# EAGLE design DBG-001 (EAGLE 9.6.0)

## Sheet 1 of 3
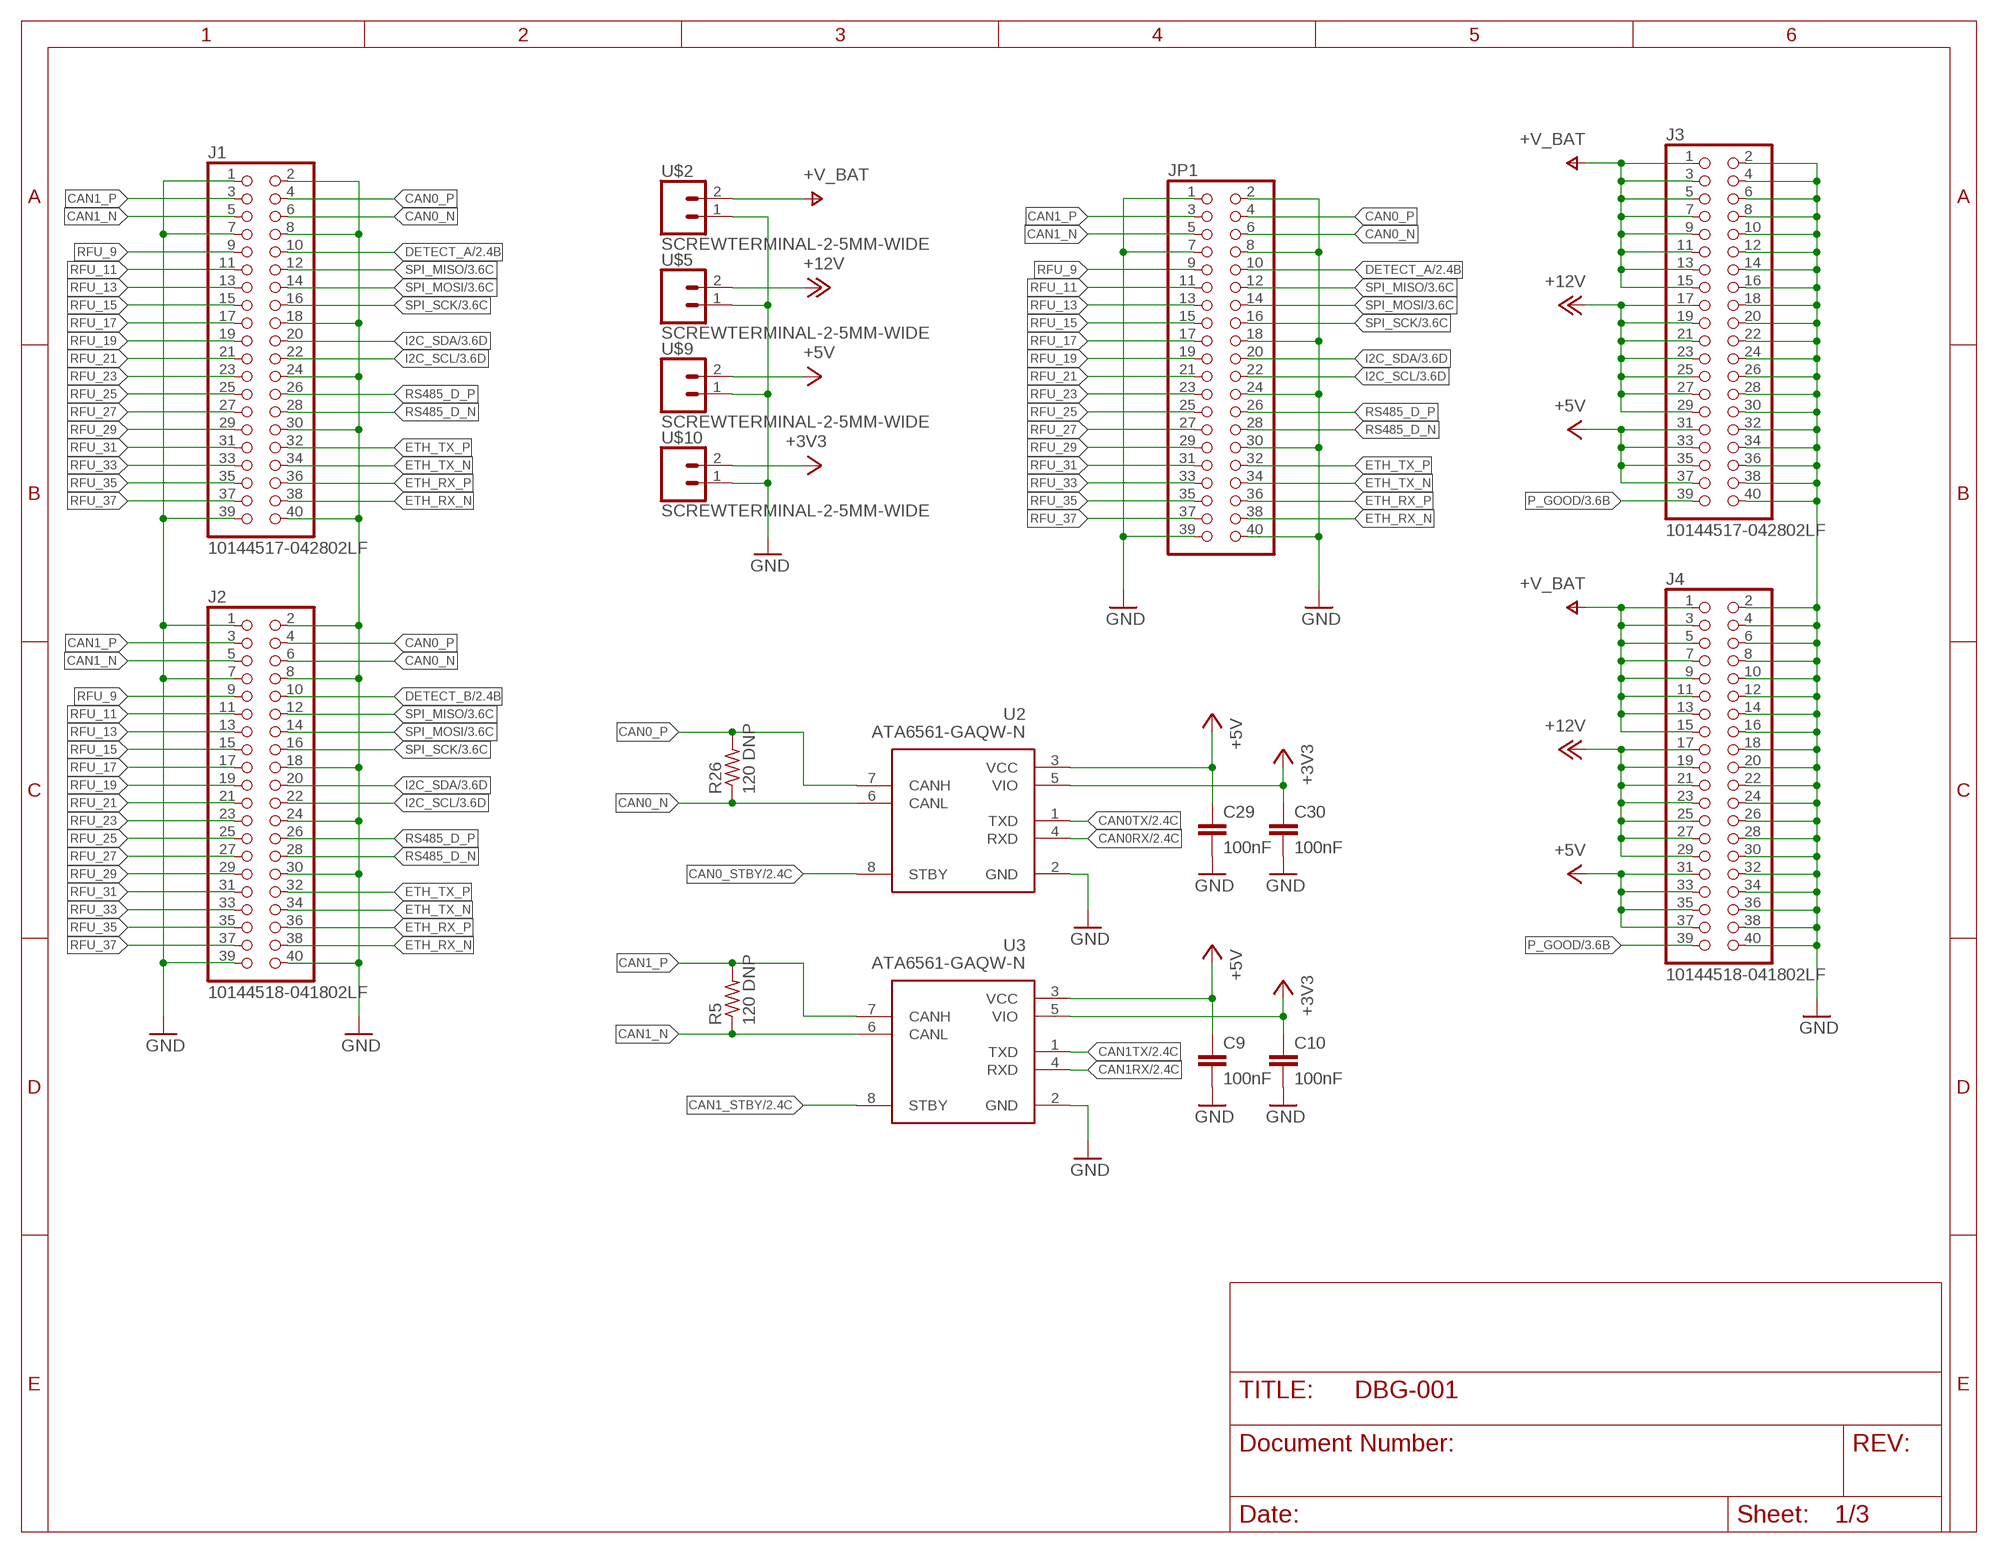
[diagram p0: schematic, sheet 1]

### Parts
C9  100nF  C-EUC0402  [C0402]
C10  100nF  C-EUC0402  [C0402]
C29  100nF  C-EUC0402  [C0402]
C30  100nF  C-EUC0402  [C0402]
J1  10144517-042802LF  [10144517-042802LF]
J2  10144518-041802LF  [10144518-041802LF]
J3  10144517-042802LF  [10144517-042802LF]
J4  10144518-041802LF  [10144518-041802LF]
JP1  PINHD-2X20  [2X20]
R5  120 DNP  R-US_R0402  [R0402]
R26  120 DNP  R-US_R0402  [R0402]
U2  ATA6561-GAQW-N  [SOIC127P600X175-8N]
U3  ATA6561-GAQW-N  [SOIC127P600X175-8N]
U$2  SCREWTERMINAL-2-5MM-WIDE  [SCREWTERMINAL-5MM-2-WIDE]
U$5  SCREWTERMINAL-2-5MM-WIDE  [SCREWTERMINAL-5MM-2-WIDE]
U$9  SCREWTERMINAL-2-5MM-WIDE  [SCREWTERMINAL-5MM-2-WIDE]
U$10  SCREWTERMINAL-2-5MM-WIDE  [SCREWTERMINAL-5MM-2-WIDE]

### Nets
+3V3: C10.1 C30.1 U2.5(VIO) U3.5(VIO) U$10.2 ; also sheet 2,3
+5V: C9.1 C29.1 J3.31 J3.33 J3.35 J3.37 J4.31 J4.33 J4.35 J4.37 U2.3(VCC) U3.3(VCC) U$9.2 ; also sheet 2
+12V: J3.17 J3.19 J3.21 J3.23 J3.25 J3.27 J3.29 J4.17 J4.19 J4.21 J4.23 J4.25 J4.27 J4.29 U$5.2
+V_BAT: J3.1 J3.3 J3.5 J3.7 J3.9 J3.11 J3.13 J3.15 J4.1 J4.3 J4.5 J4.7 J4.9 J4.11 J4.13 J4.15 U$2.2
CAN0_N [100ohm diff pairs]: J1.6 J2.6 JP1.6 R26.1 U2.6(CANL)
CAN0_P [100ohm diff pairs]: J1.4 J2.4 JP1.4 R26.2 U2.7(CANH)
CAN0_STBY: U2.8(STBY) ; also sheet 2,3
CAN0RX: U2.4(RXD) ; also sheet 2,3
CAN0TX: U2.1(TXD) ; also sheet 2,3
CAN1_N [100ohm diff pairs]: J1.5 J2.5 JP1.5 R5.1 U3.6(CANL)
CAN1_P [100ohm diff pairs]: J1.3 J2.3 JP1.3 R5.2 U3.7(CANH)
CAN1_STBY: U3.8(STBY) ; also sheet 2,3
CAN1RX: U3.4(RXD) ; also sheet 2,3
CAN1TX: U3.1(TXD) ; also sheet 2,3
DETECT_A: J1.10 JP1.10 ; also sheet 2,3
DETECT_B: J2.10 ; also sheet 2,3
ETH_RX_N [100ohm diff pairs]: J1.38 J2.38 JP1.38
ETH_RX_P [100ohm diff pairs]: J1.36 J2.36 JP1.36
ETH_TX_N [100ohm diff pairs]: J1.34 J2.34 JP1.34
ETH_TX_P [100ohm diff pairs]: J1.32 J2.32 JP1.32
GND: C9.2 C10.2 C29.2 C30.2 J1.1 J1.2 J1.7 J1.8 J1.18 J1.24 J1.30 J1.39 J1.40 J2.1 J2.2 J2.7 J2.8 J2.18 J2.24 J2.30 J2.39 J2.40 J3.2 J3.4 J3.6 J3.8 J3.10 J3.12 J3.14 J3.16 J3.18 J3.20 J3.22 J3.24 J3.26 J3.28 J3.30 J3.32 J3.34 J3.36 J3.38 J3.40 J4.2 J4.4 J4.6 J4.8 J4.10 J4.12 J4.14 J4.16 J4.18 J4.20 J4.22 J4.24 J4.26 J4.28 J4.30 J4.32 J4.34 J4.36 J4.38 J4.40 JP1.1 JP1.2 JP1.7 JP1.8 JP1.18 JP1.24 JP1.30 JP1.39 JP1.40 U2.2(GND) U3.2(GND) U$2.1 U$5.1 U$9.1 U$10.1 ; also sheet 2,3
I2C_SCL: J1.22 J2.22 JP1.22 ; also sheet 3
I2C_SDA: J1.20 J2.20 JP1.20 ; also sheet 3
P_GOOD: J3.39 J4.39 ; also sheet 3
RFU_9: J1.9 J2.9 JP1.9
RFU_11: J1.11 J2.11 JP1.11
RFU_13: J1.13 J2.13 JP1.13
RFU_15: J1.15 J2.15 JP1.15
RFU_17: J1.17 J2.17 JP1.17
RFU_19: J1.19 J2.19 JP1.19
RFU_21: J1.21 J2.21 JP1.21
RFU_23: J1.23 J2.23 JP1.23
RFU_25: J1.25 J2.25 JP1.25
RFU_27: J1.27 J2.27 JP1.27
RFU_29: J1.29 J2.29 JP1.29
RFU_31: J1.31 J2.31 JP1.31
RFU_33: J1.33 J2.33 JP1.33
RFU_35: J1.35 J2.35 JP1.35
RFU_37: J1.37 J2.37 JP1.37
RS485_D_N [100ohm diff pairs]: J1.28 J2.28 JP1.28
RS485_D_P [100ohm diff pairs]: J1.26 J2.26 JP1.26
SPI_MISO: J1.12 J2.12 JP1.12 ; also sheet 3
SPI_MOSI: J1.14 J2.14 JP1.14 ; also sheet 3
SPI_SCK: J1.16 J2.16 JP1.16 ; also sheet 3

## Sheet 2 of 3
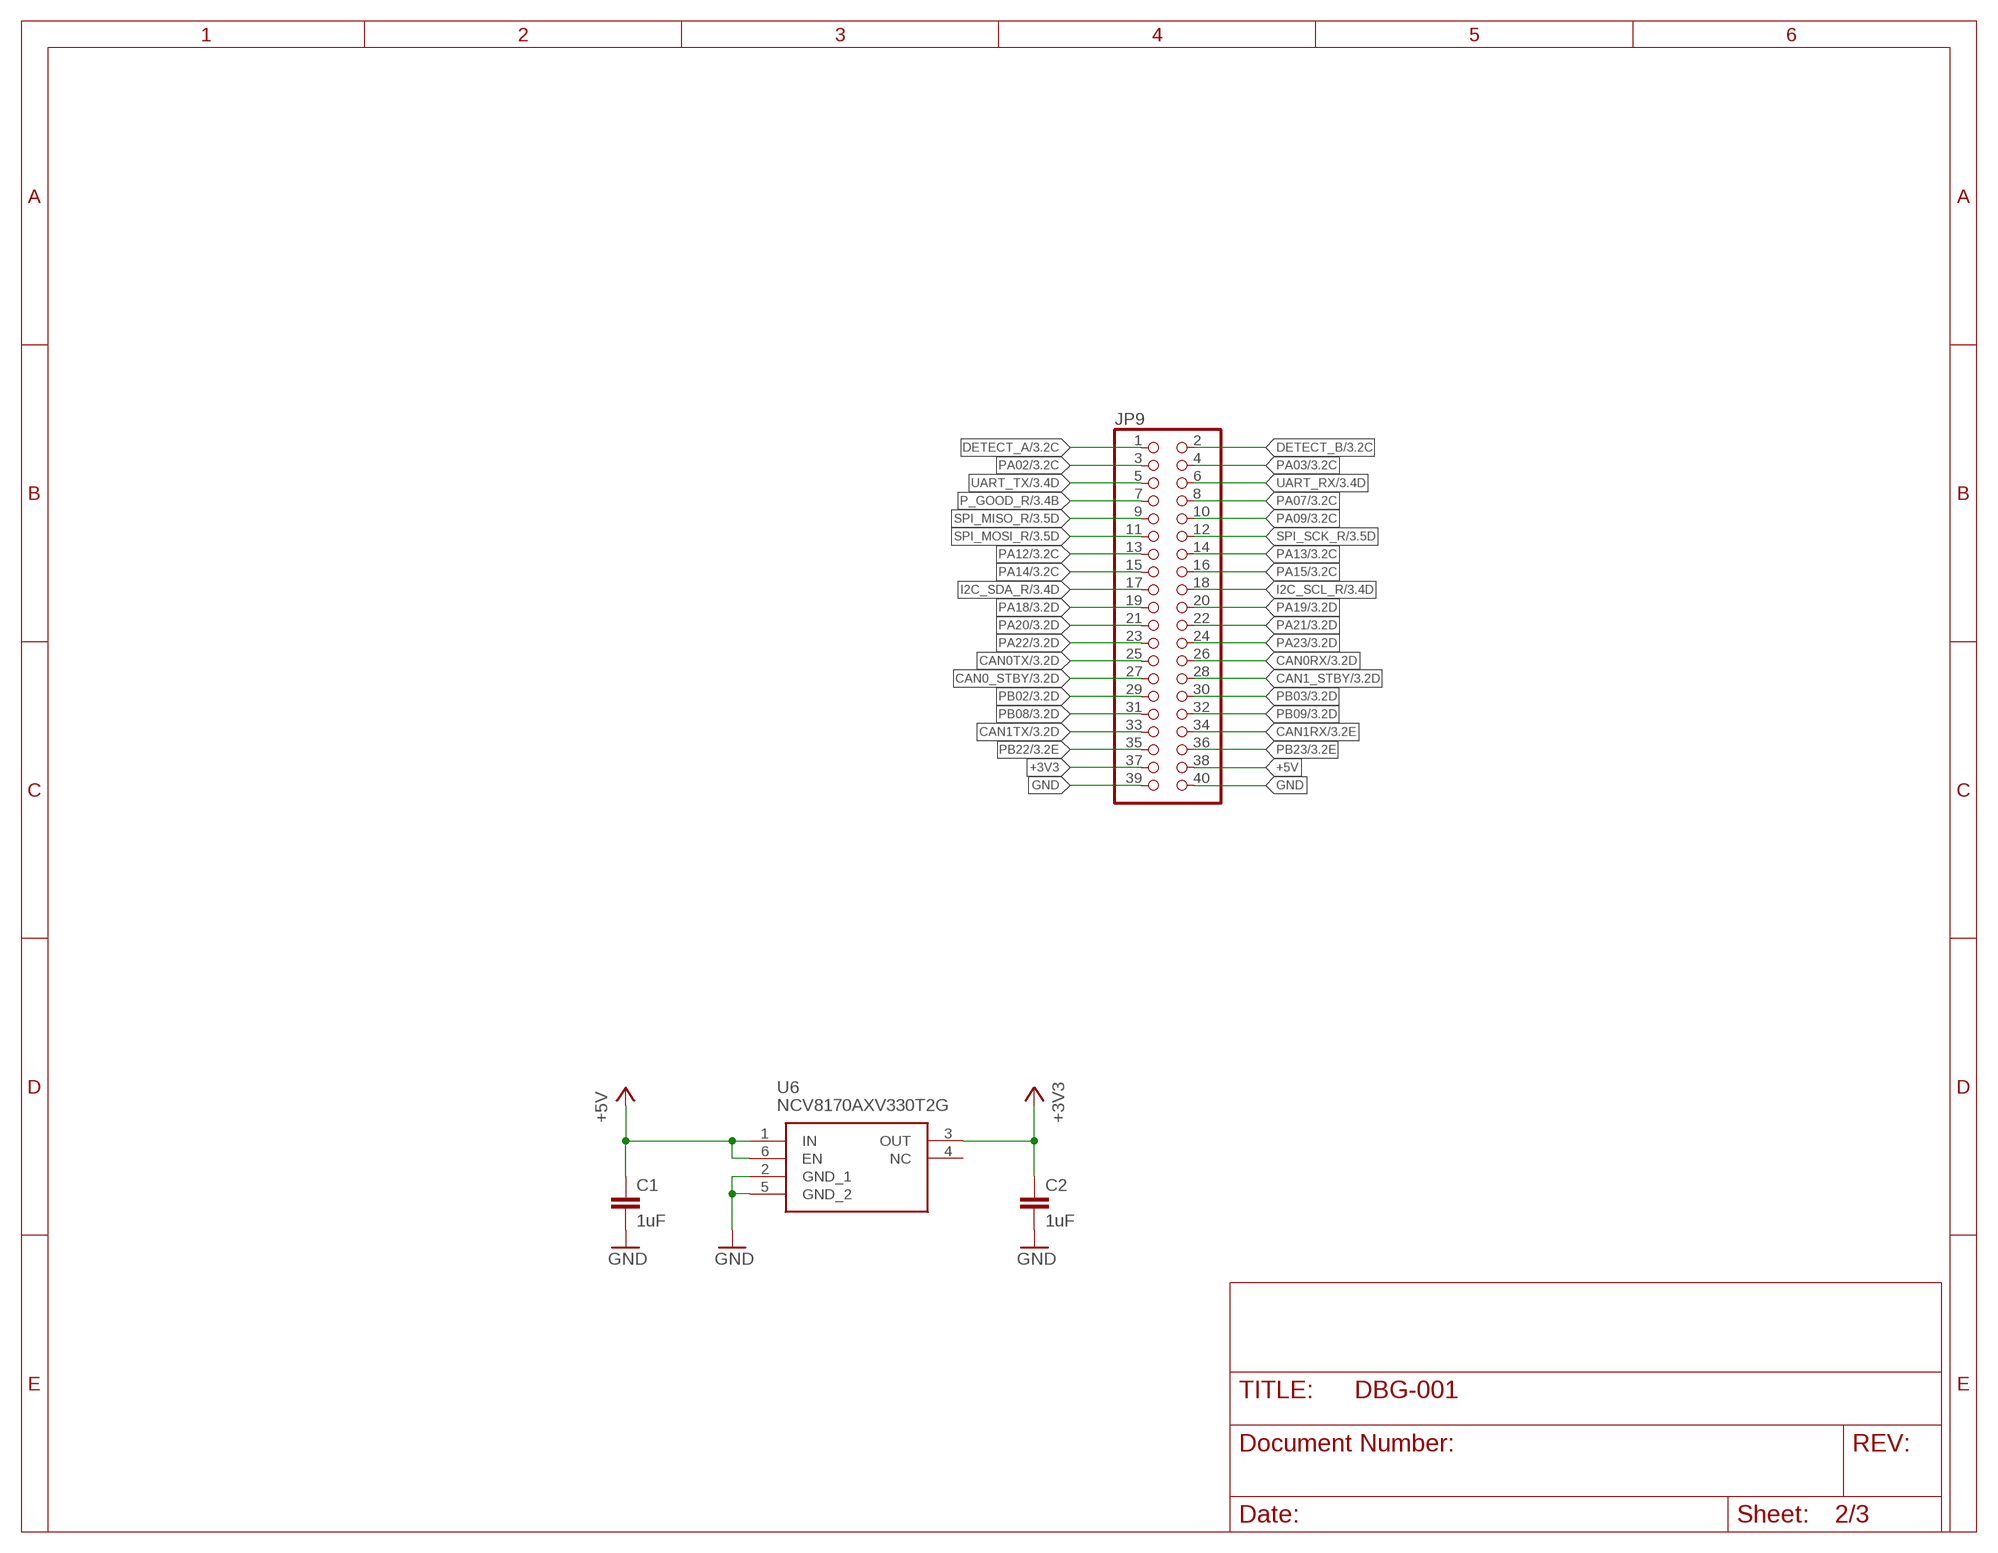
[diagram p1: schematic, sheet 2]

### Parts
C1  1uF  C-EUC0603  [C0603]
C2  1uF  C-EUC0603  [C0603]
JP9  PINHD-2X20  [2X20]
U6  NCV8170AXV330T2G  [SOTFL50P160X60-6N]

### Nets
+3V3: C2.1 JP9.37 U6.3(OUT) ; also sheet 1,3
+5V: C1.1 JP9.38 U6.1(IN) U6.6(EN) ; also sheet 1
CAN0_STBY: JP9.27 ; also sheet 1,3
CAN0RX: JP9.26 ; also sheet 1,3
CAN0TX: JP9.25 ; also sheet 1,3
CAN1_STBY: JP9.28 ; also sheet 1,3
CAN1RX: JP9.34 ; also sheet 1,3
CAN1TX: JP9.33 ; also sheet 1,3
DETECT_A: JP9.1 ; also sheet 1,3
DETECT_B: JP9.2 ; also sheet 1,3
GND: C1.2 C2.2 JP9.39 JP9.40 U6.2(GND_1) U6.5(GND_2) ; also sheet 1,3
I2C_SCL_R: JP9.18 ; also sheet 3
I2C_SDA_R: JP9.17 ; also sheet 3
P_GOOD_R: JP9.7 ; also sheet 3
PA02: JP9.3 ; also sheet 3
PA03: JP9.4 ; also sheet 3
PA07: JP9.8 ; also sheet 3
PA09: JP9.10 ; also sheet 3
PA12: JP9.13 ; also sheet 3
PA13: JP9.14 ; also sheet 3
PA14: JP9.15 ; also sheet 3
PA15: JP9.16 ; also sheet 3
PA18: JP9.19 ; also sheet 3
PA19: JP9.20 ; also sheet 3
PA20: JP9.21 ; also sheet 3
PA21: JP9.22 ; also sheet 3
PA22: JP9.23 ; also sheet 3
PA23: JP9.24 ; also sheet 3
PB02: JP9.29 ; also sheet 3
PB03: JP9.30 ; also sheet 3
PB08: JP9.31 ; also sheet 3
PB09: JP9.32 ; also sheet 3
PB22: JP9.35 ; also sheet 3
PB23: JP9.36 ; also sheet 3
SPI_MISO_R: JP9.9 ; also sheet 3
SPI_MOSI_R: JP9.11 ; also sheet 3
SPI_SCK_R: JP9.12 ; also sheet 3
UART_RX: JP9.6 ; also sheet 3
UART_TX: JP9.5 ; also sheet 3
Unconnected: U6.4(NC)

## Sheet 3 of 3
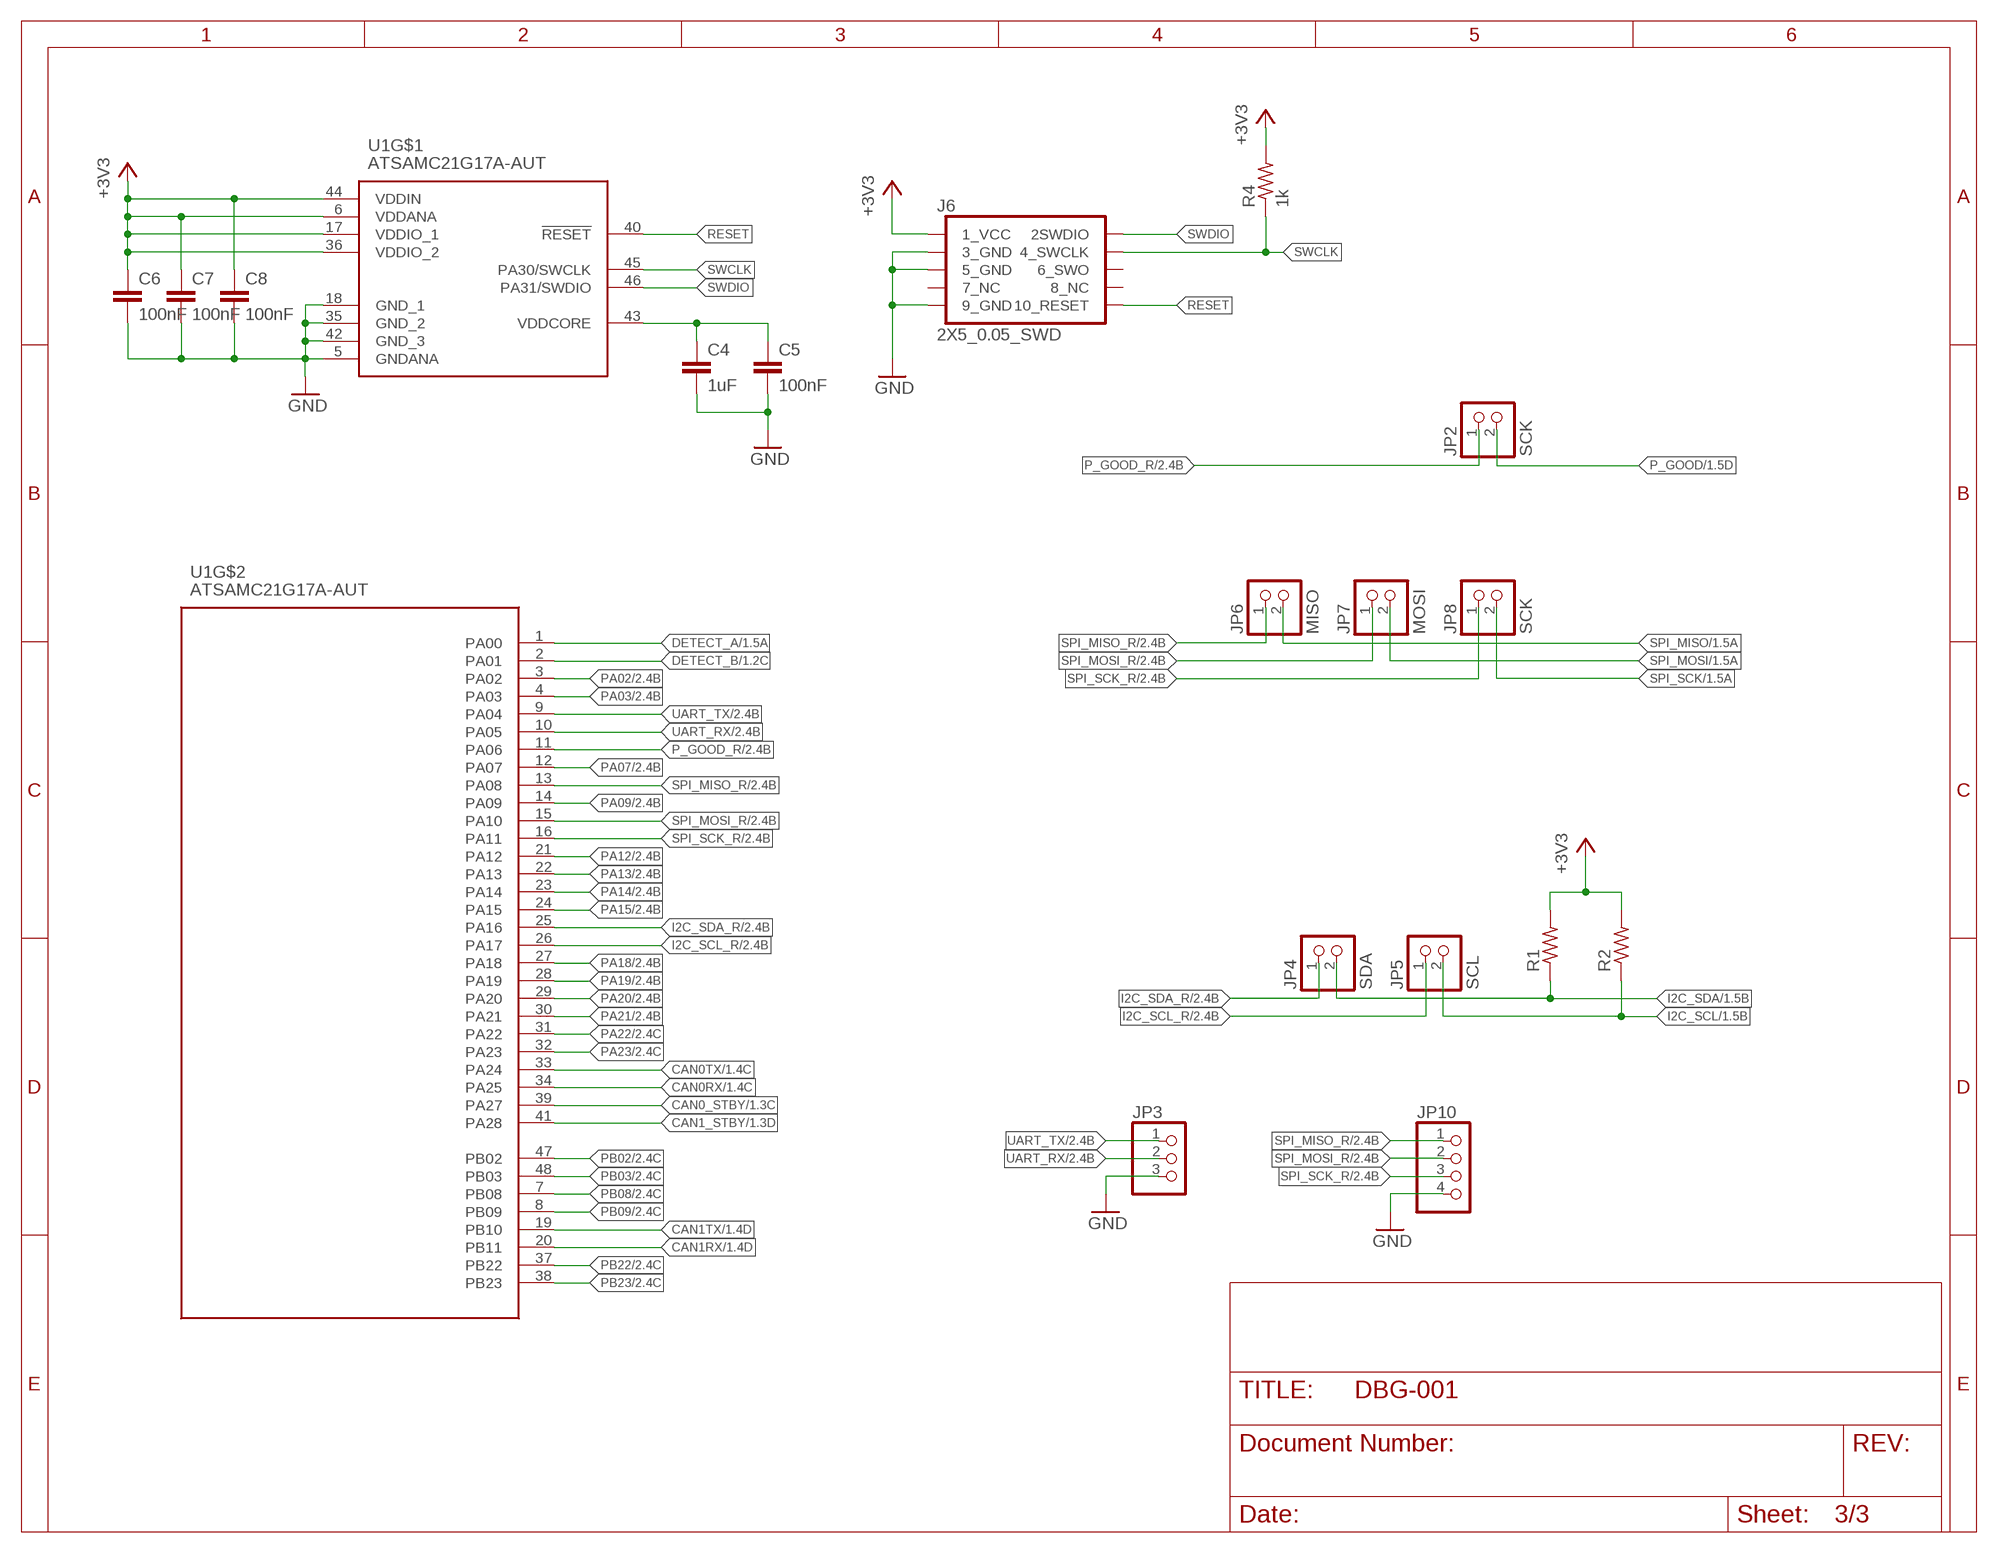
[diagram p2: schematic, sheet 3]

### Parts
C4  1uF  C-EUC0805  [C0805]
C5  100nF  C-EUC0805  [C0805]
C6  100nF  C-EUC0805  [C0805]
C7  100nF  C-EUC0805  [C0805]
C8  100nF  C-EUC0805  [C0805]
J6  2X5_0.05_SWD  [2X5_RIGHT]
JP2  SCK  PINHD-1X2  [1X02]
JP3  PINHD-1X3  [1X03]
JP4  SDA  PINHD-1X2  [1X02]
JP5  SCL  PINHD-1X2  [1X02]
JP6  MISO  PINHD-1X2  [1X02]
JP7  MOSI  PINHD-1X2  [1X02]
JP8  SCK  PINHD-1X2  [1X02]
JP10  PINHD-1X4  [1X04]
R1  R-US_R0805  [R0805]
R2  R-US_R0805  [R0805]
R4  1k  R-US_R0402  [R0402]
U1  ATSAMC21G17A-AUT  [QFP50P900X900X120-48N]

### Nets
+3V3: C6.1 C7.1 C8.1 J6.1(1_VCC) R1.2 R2.2 R4.2 U1.6(VDDANA) U1.17(VDDIO_1) U1.36(VDDIO_2) U1.44(VDDIN) ; also sheet 1,2
CAN0_STBY: U1.39(PA27) ; also sheet 1,2
CAN0RX: U1.34(PA25) ; also sheet 1,2
CAN0TX: U1.33(PA24) ; also sheet 1,2
CAN1_STBY: U1.41(PA28) ; also sheet 1,2
CAN1RX: U1.20(PB11) ; also sheet 1,2
CAN1TX: U1.19(PB10) ; also sheet 1,2
DETECT_A: U1.1(PA00) ; also sheet 1,2
DETECT_B: U1.2(PA01) ; also sheet 1,2
GND: C4.2 C5.2 C6.2 C7.2 C8.2 J6.3(3_GND) J6.5(5_GND) J6.9(9_GND) JP3.3 JP10.4 U1.5(GNDANA) U1.18(GND_1) U1.35(GND_2) U1.42(GND_3) ; also sheet 1,2
I2C_SCL: JP5.2 R2.1 ; also sheet 1
I2C_SCL_R: JP5.1 U1.26(PA17) ; also sheet 2
I2C_SDA: JP4.2 R1.1 ; also sheet 1
I2C_SDA_R: JP4.1 U1.25(PA16) ; also sheet 2
N$1: C4.1 C5.1 U1.43(VDDCORE)
P_GOOD: JP2.2 ; also sheet 1
P_GOOD_R: JP2.1 U1.11(PA06) ; also sheet 2
PA02: U1.3(PA02) ; also sheet 2
PA03: U1.4(PA03) ; also sheet 2
PA07: U1.12(PA07) ; also sheet 2
PA09: U1.14(PA09) ; also sheet 2
PA12: U1.21(PA12) ; also sheet 2
PA13: U1.22(PA13) ; also sheet 2
PA14: U1.23(PA14) ; also sheet 2
PA15: U1.24(PA15) ; also sheet 2
PA18: U1.27(PA18) ; also sheet 2
PA19: U1.28(PA19) ; also sheet 2
PA20: U1.29(PA20) ; also sheet 2
PA21: U1.30(PA21) ; also sheet 2
PA22: U1.31(PA22) ; also sheet 2
PA23: U1.32(PA23) ; also sheet 2
PB02: U1.47(PB02) ; also sheet 2
PB03: U1.48(PB03) ; also sheet 2
PB08: U1.7(PB08) ; also sheet 2
PB09: U1.8(PB09) ; also sheet 2
PB22: U1.37(PB22) ; also sheet 2
PB23: U1.38(PB23) ; also sheet 2
RESET: J6.10(10_RESET) U1.40(!RESET)
SPI_MISO: JP6.2 ; also sheet 1
SPI_MISO_R: JP6.1 JP10.1 U1.13(PA08) ; also sheet 2
SPI_MOSI: JP7.2 ; also sheet 1
SPI_MOSI_R: JP7.1 JP10.2 U1.15(PA10) ; also sheet 2
SPI_SCK: JP8.2 ; also sheet 1
SPI_SCK_R: JP8.1 JP10.3 U1.16(PA11) ; also sheet 2
SWCLK: J6.4(4_SWCLK) R4.1 U1.45(PA30/SWCLK)
SWDIO: J6.2(2SWDIO) U1.46(PA31/SWDIO)
UART_RX: JP3.2 U1.10(PA05) ; also sheet 2
UART_TX: JP3.1 U1.9(PA04) ; also sheet 2
Unconnected: J6.6(6_SWO) J6.7(7_NC) J6.8(8_NC)

## Library data of the parts
C1 C2 C4-C10 C29 C30 = rcl:C-EU: CAPACITOR, European symbol; SPICEPREFIX: C
J1 J3 = BergStak:10144517-04
J2 J4 = BergStak:10144518-04
J6 = Headers:2X5_0.05_SWD
JP1 JP9 = pinhead:PINHD-2X20: PIN HEADER
JP2 JP4-JP8 = pinhead:PINHD-1X2: PIN HEADER
JP3 = pinhead:PINHD-1X3: PIN HEADER
JP10 = pinhead:PINHD-1X4: PIN HEADER
R1 R2 R4 R5 R26 = rcl:R-US_: RESISTOR, American symbol; SPICEPREFIX: R
U1 = ATSAM:ATSAMC21G17A-AUT: ARM Microcontrollers - MCU 48TQFP,85C TEMP, GREEN, 5V, 48MHZ, T&R Source: Datasheet <http://ww1.microchip.com/downloads/en/DeviceDoc/SAMC20_C21_%20Family_Data_%20Sheet_DS60001479D.pdf>
U2 U3 = SamacSys Managed:ATA6561-GAQW-N: MICROCHIP - ATA6561-GAQW-N - CAN TRANSCEIVER, 5MBPS, -40 TO 150DEG C Source: Datasheet <https://componentsearchengine.com/Datasheets/1/ATA6561-GAQW-N.pdf>; DESCRIPTION: MICROCHIP - ATA6561-GAQW-N - CAN TRANSCEIVER, 5MBPS, -40 TO 150DEG C; HEIGHT: 1.75mm; MANUFACTURER_NAME: Microchip; MANUFACTURER_PART_NUMBER: ATA6561-GAQW-N; MOUSER_PART_NUMBER: 579-ATA6561-GAQW-N; MOUSER_PRICE-STOCK: https://www.mouser.com/Search/Refine.aspx?Keyword=579-ATA6561-GAQW-N
U6 = SamacSys_Parts:NCV8170AXV330T2G: ON Semiconductor NCV8170AXV330T2G, LDO Voltage Regulator, 3.3 V +/-1%, 2.2 5.5 Vin, 6-Pin SOT-563 Source: Datasheet <https://componentsearchengine.com/Datasheets/1/NCV8170AXV330T2G.pdf>; DESCRIPTION: ON Semiconductor NCV8170AXV330T2G, LDO Voltage Regulator, 3.3 V +/-1%, 2.2 5.5 Vin, 6-Pin SOT-563; HEIGHT: 0.6mm; MANUFACTURER_NAME: ON Semiconductor; MANUFACTURER_PART_NUMBER: NCV8170AXV330T2G; MOUSER_PART_NUMBER: 863-NCV8170AXV330T2G; MOUSER_PRICE-STOCK: https://www.mouser.com/Search/Refine.aspx?Keyword=863-NCV8170AXV330T2G
U$2 U$5 U$9 U$10 = screw terminals:SCREWTERMINAL-2

## Net classes
1 100ohm diff pairs: width 0.635 mm

## Board
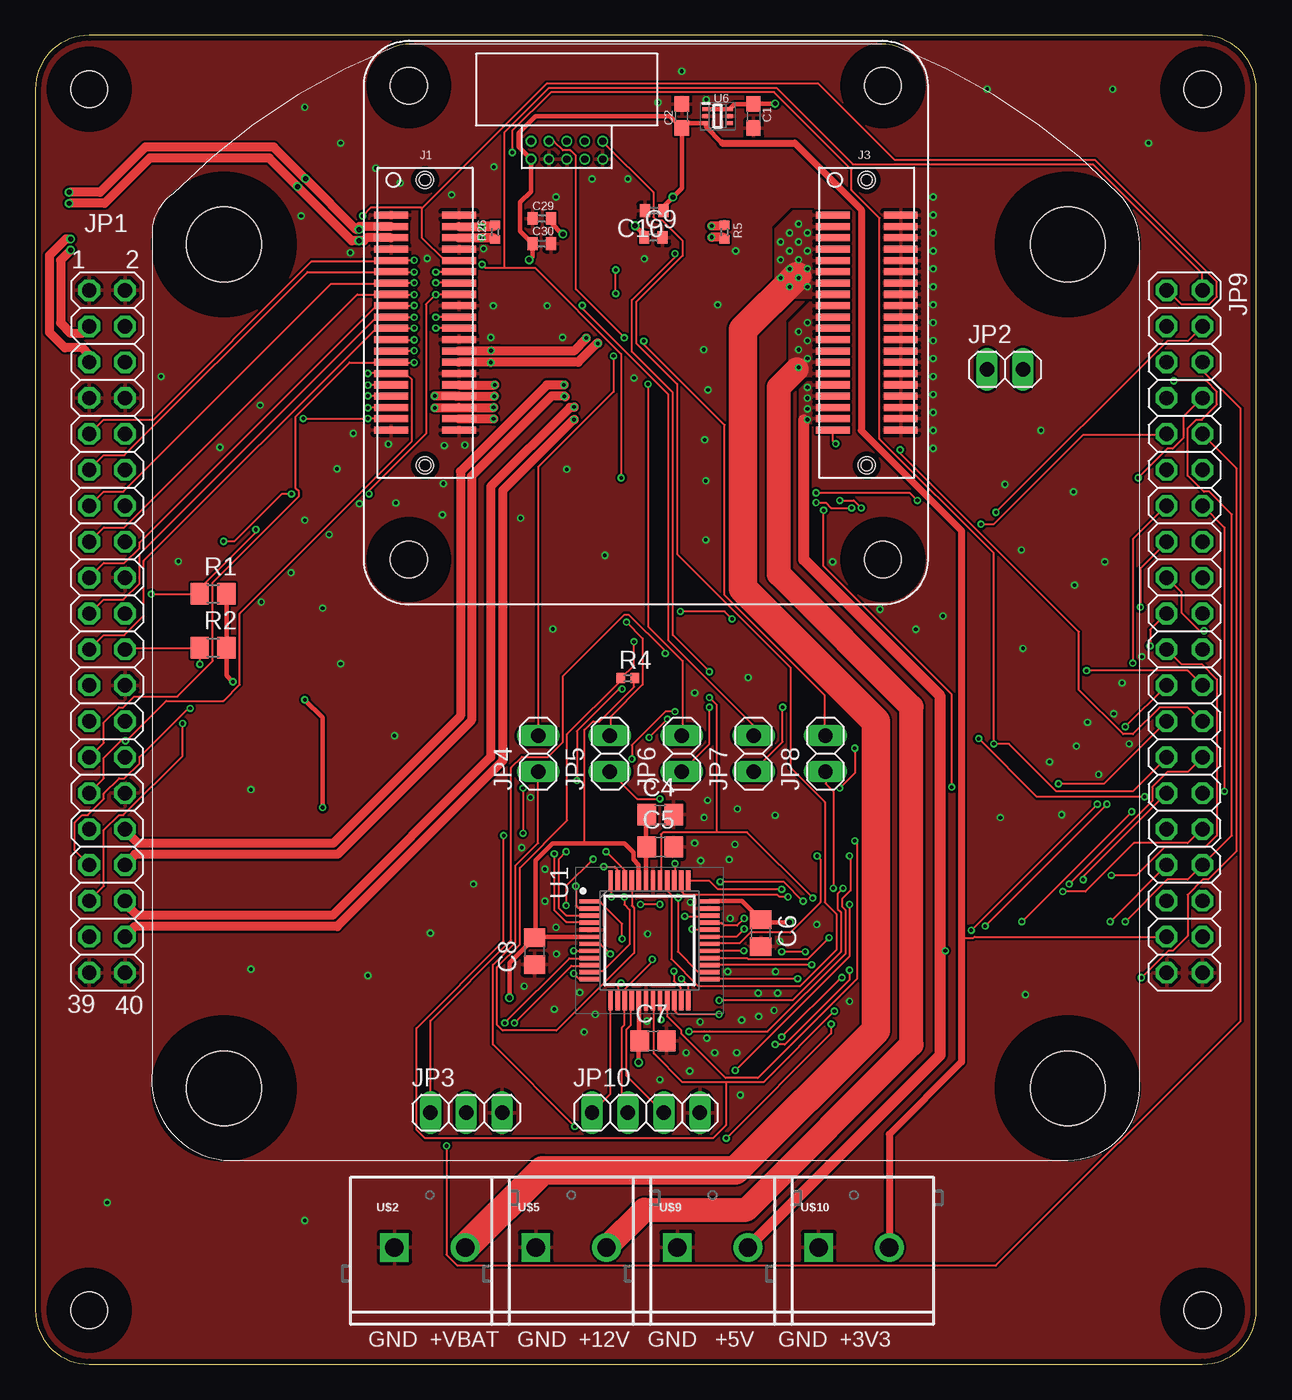
[diagram p3: board, top side]
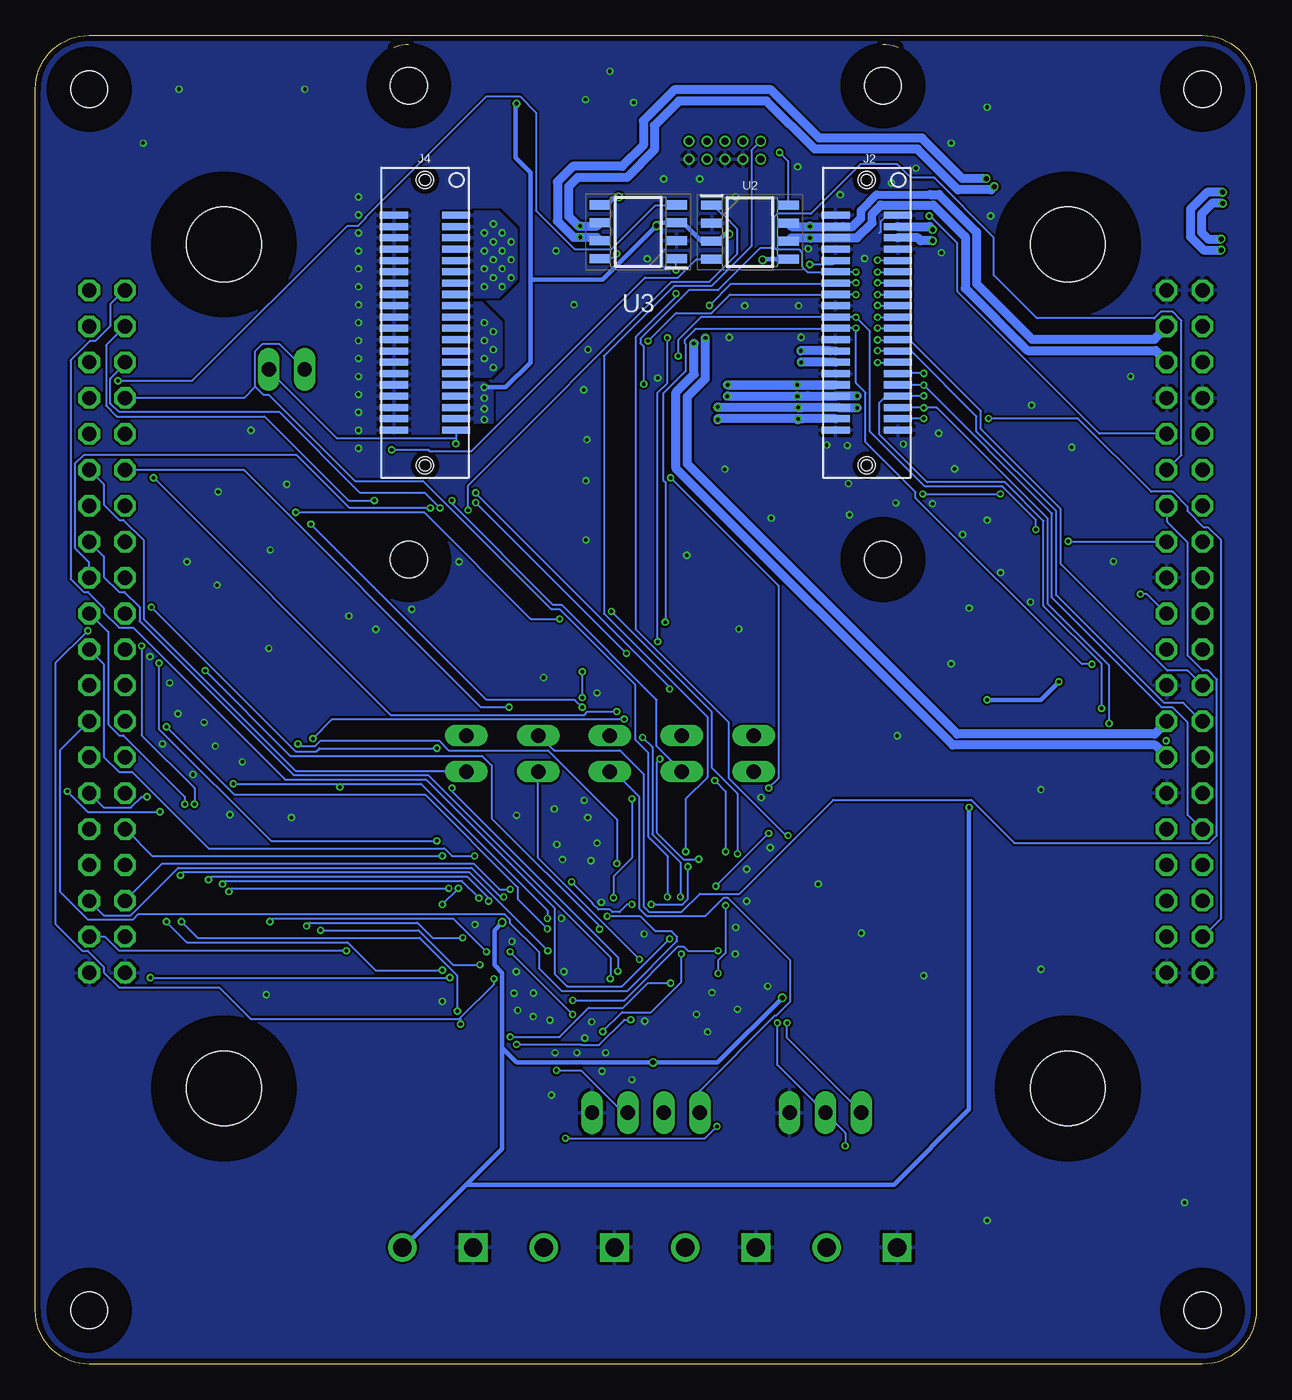
[diagram p4: board, bottom side, seen from below]

Size 86.36 x 93.98 mm. Coordinates in mm from the lower left corner, seen from the top.
Outline: 61.04,93.14 arc21 59.94,93.34
Outline: 26.42,93.34 arc21 25.32,93.14
Outline: 0,90.17 0,3.81 arc90 3.81,0 82.55,0 arc90 86.36,3.81 86.36,90.17 arc90 82.55,93.98 3.81,93.98 arc90 0,90.17
Copper layers (1*16): Top 0.035559375mm / dielectric 1.6mm / Bottom 0.035559375mm
Design rules "oshpark-2layer": minimum track width 6mil, minimum drill 10mil, track to track 6mil, track to pad 6mil, pad to pad 6mil, via to via 6mil, smd to smd 6mil, copper to edge 15mil, drill to drill 6mil, minimum pad ring 5mil, minimum via ring 5mil, stop-mask expansion 2.5mil, vias tented up to drill 0mil, thermal gap 10mil
Holes 2.6 mm at 26.42,56.9 26.42,90.42 59.94,90.42 59.94,56.9 3.81,90.17 82.55,90.17 82.55,3.81 3.81,3.81
Holes 5.3 mm at 73.03,19.51 13.34,19.51 13.34,79.2 73.03,79.2
tRestrict: area 57,87.5 to 62.9,93.3; area 57,54 to 62.9,59.8; area 23.5,54 to 29.3,59.8; area 23.5,87.5 to 29.3,93.3; area 8.3,14.4 to 18.4,24.6; area 8.3,74.1 to 18.4,84.3; area 67.9,74.1 to 78.1,84.3; area 67.9,14.4 to 78.1,24.6; area 0.9,87.2 to 6.7,93.1; area 79.6,87.2 to 85.5,93.1; area 79.6,0.9 to 85.5,6.7; area 0.9,0.9 to 6.7,6.7
bRestrict: area 57,87.5 to 62.9,93.3; area 57,54 to 62.9,59.8; area 23.5,54 to 29.3,59.8; area 23.5,87.5 to 29.3,93.3; area 8.3,14.4 to 18.4,24.6; area 8.3,74.1 to 18.4,84.3; area 67.9,74.1 to 78.1,84.3; area 67.9,14.4 to 78.1,24.6; area 0.9,87.2 to 6.7,93.1; area 79.6,87.2 to 85.5,93.1; area 79.6,0.9 to 85.5,6.7; area 0.9,0.9 to 6.7,6.7
vRestrict: area 74.9,73.7 to 81.3,80; area 43.2,73.7 to 49.5,80; area 43.2,105.4 to 49.5,111.8; area 74.9,105.4 to 81.3,111.8

### Footprints (pad centres in the part's own frame; a part is rotated, then mirrored left to right if it is on the bottom)
C0603 = smd 1.1 x 1: 1 -0.85,0; 2 0.85,0
C0805 = smd 1.3 x 1.5: 1 -0.95,0; 2 0.95,0
C0402 = smd 0.7 x 0.9: 1 -0.65,0; 2 0.65,0
10144517-042802LF = smd 0.5 x 2.4: 1 7.6,2.4; 2 7.6,-2.4; 3 6.8,2.4; 4 6.8,-2.4; 5 6,2.4; 6 6,-2.4; 7 5.2,2.4; 8 5.2,-2.4; 9 4.4,2.4; 10 4.4,-2.4; 11 3.6,2.4; 12 3.6,-2.4; 13 2.8,2.4; 14 2.8,-2.4; 15 2,2.4; 16 2,-2.4; 17 1.2,2.4; 18 1.2,-2.4; 19 0.4,2.4; 20 0.4,-2.4; 21 -0.4,2.4; 22 -0.4,-2.4; 23 -1.2,2.4; 24 -1.2,-2.4; 25 -2,2.4; 26 -2,-2.4; 27 -2.8,2.4; 28 -2.8,-2.4; 29 -3.6,2.4; 30 -3.6,-2.4; 31 -4.4,2.4; 32 -4.4,-2.4; 33 -5.2,2.4; 34 -5.2,-2.4; 35 -6,2.4; 36 -6,-2.4; 37 -6.8,2.4; 38 -6.8,-2.4; 39 -7.6,2.4; 40 -7.6,-2.4 | hole 1.2: 10.1,0 | hole 0.8: -10.1,0
10144518-041802LF = smd 0.5 x 2: 1 -7.6,2.2; 2 -7.6,-2.2; 3 -6.8,2.2; 4 -6.8,-2.2; 5 -6,2.2; 6 -6,-2.2; 7 -5.2,2.2; 8 -5.2,-2.2; 9 -4.4,2.2; 10 -4.4,-2.2; 11 -3.6,2.2; 12 -3.6,-2.2; 13 -2.8,2.2; 14 -2.8,-2.2; 15 -2,2.2; 16 -2,-2.2; 17 -1.2,2.2; 18 -1.2,-2.2; 19 -0.4,2.2; 20 -0.4,-2.2; 21 0.4,2.2; 22 0.4,-2.2; 23 1.2,2.2; 24 1.2,-2.2; 25 2,2.2; 26 2,-2.2; 27 2.8,2.2; 28 2.8,-2.2; 29 3.6,2.2; 30 3.6,-2.2; 31 4.4,2.2; 32 4.4,-2.2; 33 5.2,2.2; 34 5.2,-2.2; 35 6,2.2; 36 6,-2.2; 37 6.8,2.2; 38 6.8,-2.2; 39 7.6,2.2; 40 7.6,-2.2 | hole 1.2: 10.1,0 | hole 0.8: -10.1,0
2X5_RIGHT = drill 0.508: 1 2.54,0; 2 2.54,-1.27; 3 1.27,0; 4 1.27,-1.27; 5 0,0; 6 0,-1.27; 7 -1.27,0; 8 -1.27,-1.27; 9 -2.54,0; 10 -2.54,-1.27
2X20 = drill 1.016 octagon: 1 -24.13,-1.27; 2 -24.13,1.27; 3 -21.59,-1.27; 4 -21.59,1.27; 5 -19.05,-1.27; 6 -19.05,1.27; 7 -16.51,-1.27; 8 -16.51,1.27; 9 -13.97,-1.27; 10 -13.97,1.27; 11 -11.43,-1.27; 12 -11.43,1.27; 13 -8.89,-1.27; 14 -8.89,1.27; 15 -6.35,-1.27; 16 -6.35,1.27; 17 -3.81,-1.27; 18 -3.81,1.27; 19 -1.27,-1.27; 20 -1.27,1.27; 21 1.27,-1.27; 22 1.27,1.27; 23 3.81,-1.27; 24 3.81,1.27; 25 6.35,-1.27; 26 6.35,1.27; 27 8.89,-1.27; 28 8.89,1.27; 29 11.43,-1.27; 30 11.43,1.27; 31 13.97,-1.27; 32 13.97,1.27; 33 16.51,-1.27; 34 16.51,1.27; 35 19.05,-1.27; 36 19.05,1.27; 37 21.59,-1.27; 38 21.59,1.27; 39 24.13,-1.27; 40 24.13,1.27
1X02 = drill 1.016 long: 1 -1.27,0; 2 1.27,0
1X03 = drill 1.016 long: 1 -2.54,0; 2 0,0; 3 2.54,0
1X04 = drill 1.016 long: 1 -3.81,0; 2 -1.27,0; 3 1.27,0; 4 3.81,0
R0805 = smd 1.3 x 1.5: 1 -0.95,0; 2 0.95,0
R0402 = smd 0.6 x 0.7: 1 -0.5,0; 2 0.5,0
QFP50P900X900X120-48N = smd 1.45 x 0.3: 1 -4.225,2.75; 2 -4.225,2.25; 3 -4.225,1.75; 4 -4.225,1.25; 5 -4.225,0.75; 6 -4.225,0.25; 7 -4.225,-0.25; 8 -4.225,-0.75; 9 -4.225,-1.25; 10 -4.225,-1.75; 11 -4.225,-2.25; 12 -4.225,-2.75; 25 4.225,-2.75; 26 4.225,-2.25; 27 4.225,-1.75; 28 4.225,-1.25; 29 4.225,-0.75; 30 4.225,-0.25; 31 4.225,0.25; 32 4.225,0.75; 33 4.225,1.25; 34 4.225,1.75; 35 4.225,2.25; 36 4.225,2.75 | smd 0.3 x 1.45: 13 -2.75,-4.225; 14 -2.25,-4.225; 15 -1.75,-4.225; 16 -1.25,-4.225; 17 -0.75,-4.225; 18 -0.25,-4.225; 19 0.25,-4.225; 20 0.75,-4.225; 21 1.25,-4.225; 22 1.75,-4.225; 23 2.25,-4.225; 24 2.75,-4.225; 37 2.75,4.225; 38 2.25,4.225; 39 1.75,4.225; 40 1.25,4.225; 41 0.75,4.225; 42 0.25,4.225; 43 -0.25,4.225; 44 -0.75,4.225; 45 -1.25,4.225; 46 -1.75,4.225; 47 -2.25,4.225; 48 -2.75,4.225
SOIC127P600X175-8N = smd 1.5 x 0.65: 1 -2.7,1.905; 2 -2.7,0.635; 3 -2.7,-0.635; 4 -2.7,-1.905; 5 2.7,-1.905; 6 2.7,-0.635; 7 2.7,0.635; 8 2.7,1.905
SOTFL50P160X60-6N = smd 0.475 x 0.3: 1 -0.838,0.5; 2 -0.838,0; 3 -0.838,-0.5; 4 0.838,-0.5; 5 0.838,0; 6 0.838,0.5
SCREWTERMINAL-5MM-2-WIDE = drill 1.3 pad 2.032 square: 1 0,0 | drill 1.3 pad 2.032: 2 5,0

### Placement (x,y rotation side)
C1  50.8,88.27 270 top
C2  45.72,88.27 90 top
C4  44.2,38.86 0 top
C5  44.2,36.58 0 top
C6  51.31,30.48 270 top
C7  43.69,22.86 0 top
C8  35.31,29.21 270 top
C9  43.71,79.68 0 top
C10  43.76,81.58 180 top
C29  35.81,81.03 180 top
C30  35.81,79.25 0 top
J1  27.56,73.66 90 top
J2  27.56,73.66 270 bottom
J3  58.8,73.66 90 top
J4  58.8,73.66 270 bottom
J6  37.59,85.22 180 top
JP1  5.08,51.82 270 top
JP2  68.58,70.36 0 top
JP3  30.48,17.78 0 top
JP4  35.56,43.18 90 top
JP5  40.64,43.18 90 top
JP6  45.72,43.18 90 top
JP7  50.8,43.18 90 top
JP8  55.88,43.18 90 top
JP9  81.28,51.82 270 top
JP10  43.18,17.78 0 top
R1  12.57,54.48 0 top
R2  12.57,50.67 0 top
R4  41.91,48.51 0 top
R5  48.74,80.06 270 top
R26  32.51,80.06 90 top
U1  43.43,29.97 0 top
U2  35.81,80.06 0 bottom
U3  43.71,80.09 180 bottom
U6  48.26,88.27 0 top
U$2  25.4,8.25 0 top
U$5  35.4,8.25 0 top
U$9  45.4,8.25 0 top
U$10  55.4,8.25 0 top

### Tracks (layer width: path | path; a pad name or v marks a point on that pad's centre or on a via)
+3V3  (via drill 0.25, 0.35)
  Top 0.152: 38.84,36.83 38.84,44.86 39.45,45.47 39.9,45.47 42.34,47.9 42.34,48.51 R4.2 | JP9.37 66.42,30.23 66.34,30.15 65.51,30.15
  Top 0.305: v34.92,78.1 35.16,78.34 C30.1 34.29,80.12 34.29,82.17 35.05,82.93 J6.1 34.16,86.11 34.16,87.05 35.38,88.27 44.87,88.27 C2.1 | C2.1 46.07,87.77 U6.3 47.42,87.51 48.57,86.36 | R1.2 R2.2 13.52,48.71 v13.97,48.26 | v19.05,46.99 20.32,45.72 v20.32,39.37 | C10.1 44.41,81.88 v45.09,82.55 45.72,83.19 C2.1 | U1.6 35.37,30.22 | 35.37,30.22 C8.1 33.53,28.38 v33.53,25.91 | U1.17 42.68,22.91 | 42.68,22.91 C7.1 | U1.36 47.7,32.77 49.97,32.77 C6.1 51.5,31.24 v53.34,31.24 | U1.44 42.67,35.32 42.29,35.7 42.29,36.19 41.66,36.83 38.84,36.83 36.58,36.83 35.37,35.62 35.37,30.22 | v42.67,21.34 42.67,22.9 42.68,22.91
  Top 0.508: U$10.2 60.4,16.26 65.51,21.36 65.51,30.15 65.51,58.95 58.42,66.04 58.42,81.66 53.72,86.36 48.57,86.36
  Bottom 0.305: U2.5 34.87,78.16 v34.92,78.1 | v13.97,48.26 15.24,46.99 v19.05,46.99 | v20.32,39.37 20.32,18.03 25.65,12.7 55.88,12.7 | U$10.2 60.33,8.25 55.88,12.7 | v45.09,82.55 45.39,82.55 45.9,82.04 46.36,82.04 U3.5 | 55.88,12.7 53.34,15.24 53.34,22.35 | 53.34,22.35 53.34,27.66 53.9,28.22 53.9,30.68 v53.34,31.24 | 53.34,22.35 52.32,21.34 v42.67,21.34 38.1,21.34 v33.53,25.91
+5V  (via drill 0.25, 0.3, 0.35)
  Top 0.152: v64.36,29.23 64.01,29.23
  Top 0.305: U6.1 U6.6 49.45,89.11 C1.1 50.84,89.11 50.88,89.15 v52.32,89.15 | C29.1 36.46,80.72 37.25,79.93 v37.31,79.93 | v42.42,80.52 43.06,79.87
  Top 0.635: 43.06,79.87 C9.1
  Top 0.787: U$9.2 64.01,21.86 64.01,29.23 64.01,47.24 54.36,56.9 54.36,66.8
  Bottom 0.152: JP9.38 81.43,30.23 80.44,29.23 v64.36,29.23
  Bottom 0.305: v37.31,79.93 37.59,79.93 38.1,79.43 U2.3 39.25,79.43 40.54,80.72 U3.3 42.21,80.72 v42.42,80.52 46.23,76.71 51.33,76.71 | v54.61,69.09 53.09,69.09 51.33,70.84 51.33,76.71 | v52.32,89.15 52.4,89.15 52.4,85.32 51.33,84.25 51.33,76.71
  other vias: 54.61,68.33 54.61,67.56 54.61,66.8
  pour Top: 55.88,69.47 54.58,69.47 54.03,68.91 54.03,66.55 55.88,66.55
  pour Bottom: 55.88,69.47 54.58,69.47 54.03,68.91 54.03,66.55 55.88,66.55
+12V  (via drill 0.25)
  Top 1.702: U$5.2 43.07,10.92 50.29,10.92 61.98,22.61 61.98,46.48 52.58,55.88 52.58,69.09 53.85,70.36
  other vias: 54.61,73.66 53.98,73.02 54.61,72.39 53.98,71.75 54.61,71.12 53.98,70.48
  pour Top: 56.13,69.85 54.15,69.85 53.34,70.66 53.34,73.66 54.79,75.11 56.13,75.11
  pour Bottom: 56.13,69.85 54.13,69.85 53.34,70.64 53.34,73.66 54.76,75.08 56.13,75.08
+V_BAT  (via drill 0.25)
  Top 2.032: U$2.2 35.86,13.72 49.53,13.72 59.44,23.62 59.44,45.47 50.04,54.86 50.04,73.15 53.85,76.96
  other vias: 53.98,80.64 53.34,80.01 52.7,79.38 53.98,79.38 53.34,78.74 52.7,78.1 53.98,78.1 53.34,77.47 52.7,76.83 53.98,76.83 53.34,76.2 54.61,76.2 54.61,77.47 54.61,78.74 54.61,80.01
  pour Top: 55.88,81.53 53.59,81.53 52.32,80.26 52.32,76.71 53.59,75.44 55.88,75.44
  pour Bottom: 55.88,81.53 53.59,81.53 52.32,80.26 52.32,76.71 53.59,75.44 55.88,75.44
CAN0_N  (via drill 0.25)
  Top 0.635: J1.6 32.41,79.66 R26.1 32.42,79.65 v31.57,79.65
  Bottom 0.584: 27.19,80.71 27.19,81.35 26.56,81.98
  Bottom 0.635: U2.6 32.88,79.66 31.52,79.66 | 31.52,79.66 J2.6 | JP1.6 7.12,71.69 16.19,71.69 20.59,76.09 20.59,79.74 20.78,79.91 | J2.6 29.19,79.67 | J2.6 28.24,79.66 27.19,80.71 | 20.78,79.91 20.6,79.73 | 31.52,79.66 31.52,79.6 v31.57,79.65 | 26.56,81.98 22.84,81.98 20.78,79.91
CAN0_P  (via drill 0.25)
  Top 0.635: J1.4 32.41,80.46 R26.2 32.42,80.47 v31.57,80.47
  Bottom 0.559: 27.98,81.59 26.86,82.72 23.09,82.72
  Bottom 0.597: 27.98,81.04 27.98,81.59
  Bottom 0.635: U2.7 32.88,80.46 31.6,80.46 | 31.6,80.46 J2.4 | JP1.4 6.3,73.39 7.21,72.48 15.86,72.48 19.8,76.41 19.8,80.07 22.44,82.72 23.09,82.72 | J2.4 29.71,80.45 29.21,80.45 | J2.4 28.55,80.46 27.98,81.04 | v31.57,80.47 31.6,80.52 31.6,80.46
CAN0_STBY  (via drill 0.25)
  Top 0.152: v45.24,35.41 45.24,34.26 U1.39 | JP9.27 79.98,42.88 77.62,40.51 72.21,40.51 68.86,43.87 v67.79,43.87 67.79,57.35 59.72,65.43 59.72,81.05 57.73,83.03 57.73,84.48 52.25,89.97 36.47,89.97 33.73,87.22 v33.73,85.7
  Bottom 0.152: v45.24,35.41 45.24,38.53 50.11,43.41 57.12,43.41 57.81,44.09 66.19,44.09 66.57,43.71 67.64,43.71 v67.79,43.87 | v33.73,85.7 33.12,85.09 33.12,81.97 U2.8
CAN0RX  (via drill 0.25)
  Top 0.152: v45.92,31.67 47.6,31.67 U1.34 | v61.16,64.67 61.16,64.44 73.81,51.79 73.81,47.68 76.94,44.55 77.62,44.55 79.53,46.46 81.51,46.46 82.5,45.47 JP9.26
  Bottom 0.152: v45.92,31.67 43.56,31.67 42.49,30.61 41.35,30.61 40.97,30.23 40.97,29.92 44.48,26.42 49.15,26.42 50.74,28 50.74,29.15 52.81,31.22 52.81,31.46 53.16,31.81 53.16,31.83 79.07,31.83 79.45,31.44 82.65,31.44 84.63,33.43 84.63,43.41 82.58,45.47 JP9.26 | U2.4 39.6,78.16 40.89,76.86 43.26,76.86 55.52,64.59 58.5,64.59 58.57,64.67 v61.16,64.67
CAN0TX  (via drill 0.25)
  Top 0.152: U1.33 48.5,31.22 48.71,31.01 49.63,31.01 v50.14,31.52 | v72.36,41.05 75.56,41.05 79.98,45.47 JP9.25 | v55.75,60.4 55.75,56.44 64.82,47.37 v64.82,40.82
  Bottom 0.152: v50.14,31.52 50.14,32.11 59.08,41.05 64.82,41.05 | v72.36,41.05 64.82,41.05 | v55.75,60.4 55.75,62.15 41.35,76.56 38.68,76.56 36.7,78.54 36.7,80.29 37.69,81.28 37.77,81.28 38.46,81.97 U2.1 | 64.82,41.05 v64.82,40.82
CAN1_N  (via drill 0.25, 0.35)
  Top 0.635: J1.5 23.43,79.66 23.23,79.46 v22.9,79.46 | v22.9,79.46 22.38,79.46 | v2.39,82.09 4.9,82.09 8.1,85.29 16.54,85.29 22.38,79.46 | v2.49,79.58 2.16,79.58 0.99,78.41 0.99,72.98 2.09,71.88 3.3,71.88 3.81,71.37 JP1.5 | v22.9,79.46 22.38,79.46 | 22.38,79.46 v18.54,83.29 | v47.83,80.49 48.67,80.49 48.74,80.59 R5.1
  Bottom 0.635: J2.5 23.96,79.66 23.75,79.46 v22.9,79.46 | v2.39,82.09 3.12,82.09 3.89,81.33 3.89,80.06 3.4,79.58 v2.49,79.58 | v18.54,83.29 | v18.54,83.29 18.77,83.06 21.1,83.06 21.33,83.29 | 21.33,83.29 | 21.33,83.29 23.97,85.93 31.24,85.93 34.64,89.33 40.84,89.33 42.57,87.6 42.57,85.88 44.53,83.92 48.01,83.92 48.64,83.29 48.64,81.18 47.95,80.49 | 47.95,80.49 v47.83,80.49 | v47.83,80.49 46.64,80.49 U3.6 | v47.83,80.49 47.83,80.52 47.95,80.49
CAN1_P  (via drill 0.25, 0.35)
  Top 0.635: J1.3 22.91,80.46 v22.91,80.25 22.7,80.25 v19.1,83.84 | v2.39,82.88 4.58,82.88 7.78,86.08 16.87,86.08 19.09,83.86 | v2.49,78.79 1.78,78.08 1.78,73.63 2.51,72.9 3.3,72.9 JP1.3 | v19.1,83.84 19.09,83.86 | v22.9,80.24 22.7,80.24 v19.1,83.84 | v47.83,79.7 48.67,79.7 48.74,79.6 R5.2 | v19.1,83.84 19.1,83.87 19.09,83.86
  Bottom 0.635: J2.3 23.11,80.46 v22.9,80.24 | v2.39,82.88 3.48,82.88 4.67,81.68 4.67,79.73 3.73,78.79 v2.49,78.79 | v19.1,83.84 20.78,83.84 23.65,86.72 30.91,86.72 34.31,90.12 41.17,90.12 43.36,87.93 43.36,86.21 44.86,84.71 48.33,84.71 49.43,83.61 49.43,80.85 48.28,79.7 v47.83,79.7 | v47.83,79.7 46.67,79.7 U3.7 | 47.83,79.68 v47.83,79.7
CAN1_STBY  (via drill 0.25)
  Top 0.152: 48.21,37.62 50.34,37.62 v54.99,32.97 | 48.21,37.62 44.4,37.62 44.25,37.46 44.25,34.26 U1.41 | v73.13,33.96 78.99,39.83 78.99,40.82 80.06,41.88 81.51,41.88 JP9.28 | v45.24,78.54 45.24,78.31 42.19,75.26 42.19,71.6 45.09,68.71 45.09,51.56 v47.68,48.97 | v47.68,47.14 48.21,46.61 48.21,37.62
  Bottom 0.152: v54.99,32.97 56.21,34.19 72.9,34.19 v73.13,33.96 | v45.24,78.54 45.54,78.23 46.38,78.23 U3.8 | v47.68,47.14 v47.68,48.97
CAN1RX  (via drill 0.25)
  Top 0.152: v44.25,24.36 44.25,25.73 U1.20 | v52.32,22.61 53.01,22.61 57.58,27.18 v57.58,27.86 | v77.09,31.29 80.06,34.26 81.51,34.26 JP9.34 84.63,37.39 84.63,60.1 83.03,61.7 82.65,61.7 81.51,62.84 81.51,66.19 82.12,66.8 82.5,66.8 83.57,67.87 83.57,68.78 82.8,69.55 v80.52,69.55
  Bottom 0.152: v44.25,24.36 44.7,24.36 46.48,22.58 47.7,22.58 47.72,22.61 v52.32,22.61 | v57.58,27.86 62.31,27.86 64.29,29.84 75.64,29.84 v77.09,31.29 | v80.52,69.55 75.26,69.55 64.29,80.52 63.52,80.52 62.99,81.05 62.99,81.13 54.46,89.66 52.09,89.66 50.95,88.52 50.95,81.58 48.21,78.84 45.62,78.84 42.49,81.97 41.05,81.97 U3.4
CAN1TX  (via drill 0.25)
  Top 0.152: 48.84,19.94 51.49,19.94 v56.52,24.97 | v76.02,31.29 79.98,35.25 JP9.33 | U1.19 43.74,25.72 43.74,21.97 45.77,19.94 48.84,19.94 | v41.05,75.72 v41.05,77.39 | v33.12,37.39 33.12,29.92 26.95,23.75 26.95,16.59 27.56,15.98 47.93,15.98 48.84,16.89 48.84,19.94
  Bottom 0.152: v56.52,24.97 56.52,27.48 59.18,30.15 74.88,30.15 v76.02,31.29 | v41.05,77.39 41.05,78.16 U3.1 | v41.05,75.72 41.05,75.49 43.87,72.67 43.87,51.94 37.31,45.39 37.31,41.43 33.27,37.39 v33.12,37.39
DETECT_A  (via drill 0.25)
  Top 0.152: 27.33,81.74 27.33,79.68 28.93,78.08 29.92,78.08 J1.10 | v23.14,81.2 23.75,81.81 27.25,81.81 27.33,81.74 | v41.5,30.07 41.5,31.14 39.98,32.66 39.22,32.66 U1.1 | 27.33,81.74 36.17,90.58 55.37,90.58 60.78,85.17 74.95,85.17 83.57,76.56 83.57,75.49 83.03,74.95 81.05,74.95 80.06,75.95 JP9.1
  Bottom 0.152: v23.14,81.2 22.99,81.05 22.91,81.05 21.16,79.3 21.16,75.87 11.1,65.81 6.38,65.81 JP1.10 | v41.5,30.07 44.86,26.72 48.74,26.72 49.63,27.61 49.63,32.26 58.73,41.35 68.71,41.35 79.45,52.09 80.44,52.09 81.51,53.16 81.51,53.47 82.65,54.61 82.96,54.61 83.87,55.52 83.87,70.99 82.5,72.36 82.12,72.36 81.05,73.43 81.05,74.95 80.06,75.95 JP9.1
DETECT_B  (via drill 0.25)
  Top 0.152: v38.23,33.81 38.23,32.44 38.38,32.28 39.14,32.28 U1.2 | v34.49,40.74 v34.49,37.54 | v41.43,62.69 41.43,71.45 35.33,77.55 33.2,77.55 | 33.2,77.55 31.83,77.55 v31.6,77.77 | 33.2,77.55 33.2,87.15 36.32,90.27 52.4,90.27 57.81,84.86 74.8,84.86 82.5,77.16 82.5,75.95 JP9.2
  Bottom 0.152: v34.49,37.54 v38.23,33.81 | v34.49,40.74 33.81,41.43 33.81,55.07 v41.43,62.69 | v31.6,77.77 30,77.77 29.77,78 J2.10
ETH_RX_N  (via drill 0.25)
  Top 0.635: v38.1,66.8 38.1,66.83 33.06,61.79 33.06,42.66 21.35,30.95 7.02,30.95 JP1.38 | J1.38 32.41,66.86 v32.41,66.85
  Bottom 0.635: J2.38 32.44,66.86 | 32.44,66.86 38.1,66.86 v38.1,66.8 | 32.11,66.86 32.41,66.86 v32.41,66.85 32.44,66.8 32.44,66.86
ETH_RX_P  (via drill 0.25)
  Top 0.635: v38.1,67.69 38.1,67.65 37.81,67.65 32.21,62.05 32.21,42.92 21.02,31.74 7.19,31.74 6.3,32.63 JP1.36 | v32.41,67.67 32.41,67.65 J1.36 29.69,67.64 v28.24,67.64
  Bottom 0.635: v38.1,67.69 38.1,67.65 J2.36 29.46,67.64 v28.24,67.64 | v32.41,67.67 32.41,67.65 32.11,67.65
ETH_TX_N  (via drill 0.25)
  Top 0.635: JP1.34 6.31,35.31 7.06,36.05 21.37,36.05 30.85,45.53 30.85,62.8 36.51,68.47 37.41,68.47 37.47,68.4 v37.41,68.45 | v32.46,68.45 32.46,68.47 J1.34 29.69,68.48 v28.24,68.48
  Bottom 0.635: J2.34 29.46,68.48 v28.24,68.48 | 32.46,68.47 v32.46,68.45 v32.46,68.46 J1.34 | 32.46,68.47 31.75,68.47 | v37.41,68.45 37.4,68.47 32.46,68.47
ETH_TX_P  (via drill 0.25)
  Top 0.635: 37.41,69.25 36.18,69.25 | 36.18,69.25 30.06,63.13 30.06,45.86 21.05,36.84 7.26,36.84 6.3,37.81 JP1.32 | J1.32 32.49,69.25 v32.49,69.27 | 36.18,69.25 36.2,69.27 v37.39,69.27
  Bottom 0.635: J2.32 32.49,69.25 | 32.49,69.25 v32.49,69.27 | 37.41,69.25 37.39,69.25 | 37.39,69.25 32.49,69.25 | 37.39,69.25 v37.39,69.27 J1.32
GND  (via drill 0.25)
  Bottom 0.152: 26.67,80.01 26.59,80.09 26.59,80.8 26.13,81.26 J2.1
  other vias: 29.44,82.7 21.59,86.36 63.5,64.77 63.5,66.04 63.5,67.31 63.5,68.58 63.5,69.85 63.5,71.12 63.5,72.39 63.5,73.66 63.5,74.93 63.5,76.2 63.5,77.47 63.5,78.74 63.5,80.01 63.5,81.28 63.5,82.55 36.83,82.55 32.44,84.68 19.05,88.9 19.05,59.69 10.11,56.77 20.32,53.47 15.9,67.82 13.06,64.85 37.59,63.3 36.6,51.99 34.32,59.84 30.99,33.96 23.52,27.48 47.29,38.66 49.15,31.52 49.66,39.27 52.32,38.81 46.63,47.47 50.42,48.56 59.74,53.39 56.39,56.74 62.28,51.97 64.19,52.91 69.75,57.58 73.43,61.7 73.51,55.09 75.64,56.74 69.85,50.62 73.63,43.71 68.25,38.66 72.59,38.86 70.03,26.14 57.58,25.65 49.86,19.02 39.6,24.74 38.81,23.49 43.31,30.43 36.7,25.1 38.51,26.29 46.28,20.73 44.17,20.12 43.26,24.26 46.02,22.02 48.97,27.76 52.35,27.76 51.13,26.24 52.25,25.02 49.96,24.33 47.02,24.21 47.5,23.06 48.06,22.02 49.61,22.02 51.16,24.59 52.5,26.24 52.65,29.9 55.27,31.09 8.89,69.85 21.59,49.53 15.24,40.64 25.4,44.45 27.94,30.48 15.24,27.94 19.05,10.16 5.08,11.43 48.26,74.93 49.53,78.74 45.72,91.44 67.31,90.17 76.2,90.17 78.74,86.36 71.12,66.04 68.58,62.23 47.57,68.91 47.27,71.75 47.42,62.48 47.35,65.38 47.42,58.29 42.34,69.75 40.28,57.2 27.71,78.21 44.04,89.23 47.45,89.43 22.28,78.61 18.8,81.2 25.81,83.54 24.08,84.58 46.33,32.66 34.57,26.72 36.86,29.01 36.83,30.89 36.04,32.74 36.04,35 34.39,36.53 35.03,40.08 32.38,74.85 36.2,74.85 32.21,72.62 37.29,72.62 22.48,65.84 21.34,63.32 39.37,83.82 41.91,83.82 43.08,78.18 75.21,41.71 77.37,43.87 78.26,50.04 76.86,48.18 76.28,46 74.42,45.39 71.73,42.6 47.55,39.88 46.63,36.86 47.07,35.61 49.48,36.75 49.07,35.69 24.97,65.07 28.93,64.97 30.38,65 28.85,62.28 25.5,60.91 28.78,60.07 22.91,60.86 15.98,53.9 18.08,55.98 20.78,58.67 31.7,78.89
  pour Top (rank 2): 0,93.98 86.36,93.98 86.36,0 0,0
  pour Bottom (rank 2): 86.36,93.98 0,93.98 0,0 86.36,0
I2C_SCL  (via drill 0.25)
  Top 0.152: v28.32,73.28 29.92,73.28 J1.22 | JP1.22 6.45,50.65 11.56,50.65 R2.1 11.63,50.65 v11.63,49.5 | v41.81,52.48 42.95,51.33 42.95,48.06 40.66,45.77 40.66,44.47 JP5.2
  Bottom 0.152: v11.63,49.5 12.34,49.5 24.11,61.27 24.11,61.67 27.63,65.2 27.63,68.71 28.32,69.39 v28.32,73.28 29.69,73.28 J2.22 29.77,73.2 39.67,73.2 40.44,72.44 40.44,72.21 40.36,72.14 40.36,70.23 41.96,68.63 41.96,62.53 41.81,62.38 v41.81,52.48
I2C_SCL_R  (via drill 0.25)
  Top 0.152: v44.17,39.98 42.57,39.98 JP5.1 | U1.26 47.6,27.79 46.84,27.79 45.44,29.18 45.44,32.97 v45.47,32.99 | v58.42,60.55 57.89,61.09 v56.9,61.09
  Bottom 0.152: v45.47,32.99 45.47,34.49 44.17,35.79 v44.17,39.98 | v58.42,60.55 64.13,60.55 67.87,64.29 82.96,64.29 83.57,63.68 83.57,57.73 82.58,56.74 82.58,55.68 JP9.18 | v56.9,61.09 56.9,60.86 49.73,53.7 49.12,53.7 42.42,46.99 42.42,43.71 40.66,41.96 JP5.1
I2C_SDA  (via drill 0.25)
  Top 0.152: v28.32,74.04 29.92,74.04 J1.20 | v8.2,54.46 11.56,54.46 R1.1 11.63,54.53 11.63,54.84 15.6,58.8 v15.6,59.03 | JP4.2 35.56,63.45 40.89,68.78 v40.89,71.3
  Bottom 0.152: v8.2,54.46 7.75,54.46 6.38,53.09 JP1.20 | v15.6,59.03 15.6,59.71 17.96,62.08 23.44,62.08 27.33,65.96 27.33,73.05 v28.32,74.04 29.69,74.04 J2.20 29.77,74.04 39.29,74.04 40.89,72.44 v40.89,71.3
I2C_SDA_R  (via drill 0.25)
  Top 0.152: v53.92,27.25 47.68,27.25 U1.25 | v82.65,51.87 82.35,51.87 81.05,53.16 81.05,54.61 80.06,55.6 JP9.17 | JP4.1 35.56,36.85 33.96,35.25 33.96,29.84 32.36,28.24 32.36,22.61 v38.15,16.81 | v56.29,24.05 56.29,23.39 v48.87,15.98
  Bottom 0.152: v53.92,27.25 53.92,26.87 56.33,24.47 | 56.33,24.47 56.36,24.43 71.14,24.43 73.36,26.64 80.44,26.64 81.51,27.71 81.51,28.09 82.65,29.23 83.03,29.23 84.94,31.14 84.94,49.58 v82.65,51.87 | v38.15,16.81 38.99,15.98 v48.87,15.98 | v56.29,24.05 56.29,24.43 56.33,24.47
N$1
  Top 0.152: C5.1 43.26,36.63 43.18,36.63
  Top 0.305: U1.43 43.18,36.63 43.18,38.8 C4.1
P_GOOD  (via drill 0.25)
  Top 0.152: v56.62,65.1 56.4,65.32 J3.39
  Bottom 0.152: J4.39 56.6,65.51 | 56.6,65.51 56.6,65.12 v56.62,65.1 | 56.6,65.51 65.05,65.51 69.85,70.31 JP2.2
P_GOOD_R  (via drill 0.25)
  Top 0.152: v41.66,33.04 41.66,32.51 42.04,32.13 42.04,29.69 40.13,27.79 39.22,27.79 U1.11
  Bottom 0.152: v41.66,33.04 41.66,35.94 43.03,37.31 43.03,43.26 43.94,44.17 43.94,48.06 49.28,53.39 49.89,53.39 58.95,62.46 63.75,62.46 69.85,68.55 70.23,68.55 70.8,69.13 | 70.8,69.13 70.84,69.16 70.84,71.6 70.31,72.14 69.09,72.14 JP2.1 | JP9.7 71.6,68.33 70.8,69.13
PA02  (via drill 0.25)
  Top 0.152: v37.54,36.25 37.01,35.71 37.01,32.28 37.54,31.75 39.14,31.75 U1.3 | v38.3,41.27 38.3,44.78 41.27,47.75 v41.5,47.75 | v55.22,61.62 61.85,61.62 v62.38,61.09
  Bottom 0.152: v37.54,36.25 37.54,40.51 v38.3,41.27 | v41.5,47.75 41.5,47.9 v55.22,61.62 | v62.38,61.09 64.21,61.09 70.16,67.03 80.59,67.03 81.36,67.79 81.36,72.06 JP9.3
PA03  (via drill 0.25)
  Top 0.152: v36.7,36.09 36.7,32.13 37.54,31.29 39.14,31.29 U1.4 | v45.62,53.24 48.74,53.24 v49.28,52.7 | v67.94,60.25 80.06,72.36 81.51,72.36 JP9.4
  Bottom 0.152: v36.7,36.09 36.7,40.36 38.53,42.19 38.53,46.15 v45.62,53.24 | v49.28,52.7 51.33,52.7 58.88,60.25 v67.94,60.25
PA07  (via drill 0.25)
  Top 0.152: v38.08,27.63 38.46,27.25 39.14,27.25 U1.12 | v37.54,32.44 37.54,33.81 v39.45,35.71 | v42.19,42.8 42.19,43.79 44.55,46.15 v45.24,46.15 | v78,62.69 80.06,64.75 80.44,64.75 81.2,65.51 81.2,67.03 82.5,68.33 JP9.8
  Bottom 0.152: v38.08,27.63 38.08,28.55 37.54,29.08 v37.54,32.44 | v39.45,35.71 40.51,35.71 42.42,37.62 42.42,42.57 v42.19,42.8 | v45.24,46.15 47.3,46.15 47.52,45.92 61.24,45.92 v78,62.69
PA09  (via drill 0.25)
  Top 0.152: v41.43,26.95 41.2,26.72 41.2,25.81 U1.14 | v52.78,23.14 56.97,27.33 v57.05,27.33 | v78.23,27.33 80.14,29.23 80.44,29.23 81.51,30.3 81.51,33.2 82.58,34.26 82.96,34.26 84.94,36.25 84.94,63.37 82.58,65.73 JP9.10
  Bottom 0.152: v41.43,26.95 43.03,26.95 44.78,25.2 47.22,25.2 49.28,23.14 v52.78,23.14 | v78.23,27.33 v57.05,27.33
PA12  (via drill 0.25)
  Top 0.152: v57.96,37.01 58.12,36.85 58.12,27.25 51.1,20.24 48.82,20.24 45.7,23.37 45.7,23.6 44.7,24.59 44.7,25.73 U1.21 | v77.62,49.58 77.62,58.34 79.98,60.71 JP9.13
  Bottom 0.152: v57.96,37.01 69.7,37.01 77.62,44.93 v77.62,49.58
PA13  (via drill 0.25)
  Top 0.152: v48.36,24.74 45.47,24.74 45.24,24.97 45.24,25.73 U1.22 | v54.46,29.16 v52.78,29.16 | v77.55,39.06 v69.77,31.29 | v84.1,40.51 84.1,59.18 82.58,60.71 JP9.14
  Bottom 0.152: v52.78,29.16 v48.36,24.74 | v54.46,29.16 56.82,31.52 69.55,31.52 v69.77,31.29 | v77.55,39.06 82.65,39.06 v84.1,40.51
PA14  (via drill 0.25)
  Top 0.152: v45.16,27.79 45.16,27.1 45.62,26.64 45.62,25.81 U1.23 | v56.9,40.74 57.96,41.81 v57.96,43.56 | v78.16,53.54 78.16,56.29 79.98,58.11 JP9.15
  Bottom 0.152: v45.16,27.79 45.16,28.78 56.9,40.51 v56.9,40.74 | v57.96,43.56 66.27,43.56 66.5,43.33 67.94,43.33 v78.16,53.54
PA15  (via drill 0.25)
  Top 0.152: v45.7,27.25 46.15,26.8 46.15,25.81 U1.24
  Bottom 0.152: v45.7,27.25 45.7,28.78 58.57,41.66 68.1,41.66 78.99,52.55 78.99,53.54 80.06,54.61 80.44,54.61 81.51,55.68 81.51,57.12 JP9.16
PA18  (via drill 0.25)
  Top 0.152: v54.91,28.24 47.68,28.24 U1.27 | v75.11,39.6 v66.19,30.68 | v78.84,50.8 78.84,51.94 79.98,53.09 JP9.19
  Bottom 0.152: v54.91,28.24 56.82,28.24 59.26,30.68 v66.19,30.68 | v75.11,39.6 75.11,40.74 78.84,44.47 v78.84,50.8
PA19  (via drill 0.25)
  Top 0.152: v56.13,30.15 54.61,28.63 50.42,28.63 50.34,28.7 47.68,28.7 U1.28 | v75.79,39.6 v67.18,30.99
  Bottom 0.152: v56.13,30.15 58.27,30.15 59.33,31.22 66.95,31.22 v67.18,30.99 | v75.79,39.6 75.79,40.13 80.14,44.47 80.44,44.47 81.2,45.24 81.2,51.79 82.5,53.09 JP9.20
PA20  (via drill 0.25)
  Top 0.152: v50.11,29.23 47.68,29.23 U1.29 | v76.1,34.57 77.85,34.57 79.83,36.55 82.73,36.55 83.57,37.39 83.57,48.44 82.5,49.5 81.05,49.5 JP9.21
  Bottom 0.152: v50.11,29.23 55.68,34.8 75.87,34.8 v76.1,34.57
PA21  (via drill 0.25)
  Top 0.152: v55.3,35.94 55.52,35.71 55.52,32.66 53.39,30.53 50.57,30.53 49.81,29.77 47.68,29.77 U1.30
  Bottom 0.152: v55.3,35.94 56.9,35.94 57.43,36.47 74.12,36.47 79.53,41.88 80.44,41.88 81.51,42.95 81.51,49.5 JP9.22
PA22  (via drill 0.25)
  Top 0.152: v50.14,30.78 49.58,30.23 47.68,30.23 U1.31 | JP9.23 v77.09,45.08
  Bottom 0.152: v50.14,30.78 52.25,32.89 52.25,33.73 58.8,40.28 72.29,40.28 v77.09,45.08
PA23  (via drill 0.25)
  Top 0.152: v46.46,30.76 47.6,30.76 U1.32 | v74.35,49.05 81.51,49.05 JP9.24
  Bottom 0.152: v46.46,30.76 46.46,30.99 54.08,38.61 54.08,42.34 54.76,43.03 68.33,43.03 v74.35,49.05
PB02  (via drill 0.25)
  Top 0.152: v40.21,35.18 40.97,35.18 41.12,35.03 41.12,34.26 U1.47 | v44.17,32.51 v42.8,32.51 | v48.44,34.11 52.93,34.11 v54.3,32.74 | v74.12,34.26 74.12,34.49 JP9.29
  Bottom 0.152: v40.21,35.18 40.21,32.89 40.59,32.51 v42.8,32.51 | v48.44,34.11 46.94,32.61 46.94,32.56 46.53,32.16 45.72,32.16 45.55,31.98 45.03,31.98 44.5,32.51 v44.17,32.51 | v54.3,32.74 54.3,32.97 55.83,34.49 73.89,34.49 v74.12,34.26
PB03  (via drill 0.25)
  Top 0.152: v40.74,33.04 40.74,34.19 U1.48 | v44.7,45.62 v43.41,44.32 | v66.73,44.25 70.84,40.13 v78.46,40.13
  Bottom 0.152: v40.74,33.04 40.74,35.48 42.72,37.46 42.72,43.64 v43.41,44.32 | v44.7,45.62 65.35,45.62 v66.73,44.25 | v78.46,40.13 78.84,40.13 79.6,39.37 81.51,39.37 82.5,40.36 JP9.30
PB08  (via drill 0.25)
  Top 0.152: v40.66,29.01 39.98,29.69 39.22,29.69 U1.7 | v57.58,35.94 57.66,35.86 57.66,33.5 57.05,32.89 57.05,32.36 57.28,32.13 57.28,29.01 51.79,23.52 47.72,23.52 47.7,23.55 47.3,23.55 47.27,23.52 v46.23,23.52
  Bottom 0.152: v40.66,29.01 40.66,27.03 42.8,24.89 44.86,24.89 v46.23,23.52 | v57.58,35.94 78.08,35.94 79.98,37.85 JP9.31
PB09  (via drill 0.25)
  Top 0.152: v38.08,29.23 39.14,29.23 U1.8 | v48.36,25.73 53.54,25.73 56.97,29.16 56.97,31.98 56.74,32.21 56.74,33.27 v57.12,33.65 | v72.67,33.43 74.27,33.43 77.7,36.85 81.51,36.85 82.5,37.85 JP9.32
  Bottom 0.152: v38.08,29.23 40.21,29.23 40.51,29.54 40.89,29.54 44.7,25.73 v48.36,25.73 | v57.12,33.65 72.44,33.65 v72.67,33.43
PB22  (via drill 0.25)
  Top 0.152: v52.78,33.58 48.28,33.58 47.68,34.19 46.23,34.19 U1.37
  Bottom 0.152: v52.78,33.58 53.54,33.58 55.37,35.41 77.39,35.41 79.98,32.82 JP9.35
PB23  (via drill 0.25)
  Top 0.152: v53.24,33.04 52.63,33.04 52.48,33.2 45.95,33.2 45.7,33.45 45.7,34.19 U1.38
  Bottom 0.152: v53.24,33.04 53.47,33.04 55.52,35.1 76.25,35.1 79.6,31.75 81.51,31.75 82.5,32.74 JP9.36
RESET
  Top 0.152: J6.10 40.13,86.46 43.71,82.88 43.71,81.13 43.94,80.9 44.32,80.9 45.77,79.45 45.77,78.38 42.49,75.11 42.49,72.21 45.39,69.32 45.39,57.28 53.39,49.28 53.39,42.19 55.83,39.75 55.83,32.66 56.67,31.83 56.67,29.31 54.08,26.72 46.91,26.72 44.98,28.65 44.98,33.2 44.7,33.48 44.7,34.18 U1.40
RFU_9  (via drill 0.25)
  Top 0.152: v26.8,78.08 25.2,78.08 J1.9 25.12,78 19.56,78 8.36,66.8 4.85,66.8 3.86,65.81 JP1.9
  Bottom 0.152: v26.8,78.08 25.43,78.08 J2.9
RFU_11  (via drill 0.25)
  Top 0.152: v26.8,77.24 25.2,77.24 J1.11 25.12,77.24 19.25,77.24 6.3,64.29 4.85,64.29 JP1.11
  Bottom 0.152: v26.8,77.24 25.43,77.24 J2.11
RFU_13  (via drill 0.25)
  Top 0.152: v26.8,76.48 25.2,76.48 J1.13 25.12,76.4 20.93,76.4 6.22,61.7 4.85,61.7 3.86,60.71 JP1.13
  Bottom 0.152: v26.8,76.48 25.43,76.48 J2.13
RFU_15  (via drill 0.25)
  Top 0.152: v26.8,75.64 25.2,75.64 J1.15 25.12,75.64 22.76,75.64 6.3,59.18 4.85,59.18 3.86,58.19 JP1.15
  Bottom 0.152: v26.8,75.64 25.43,75.64 J2.15
RFU_17  (via drill 0.25)
  Top 0.152: v26.8,74.88 25.2,74.88 J1.17 25.12,74.8 24.05,74.8 7.37,58.11 7.37,57.73 6.3,56.67 4.85,56.67 JP1.17
  Bottom 0.152: v26.8,74.88 25.43,74.88 J2.17
RFU_19  (via drill 0.25)
  Top 0.152: v26.8,74.04 25.2,74.04 J1.19 25.12,74.04 24.13,74.04 7.37,57.28 7.37,55.22 6.22,54.08 4.85,54.08 3.86,53.09 JP1.19
  Bottom 0.152: v26.8,74.04 25.43,74.04 J2.19
RFU_21  (via drill 0.25)
  Top 0.152: v26.8,73.28 25.2,73.28 J1.21 25.12,73.2 24.05,73.2 7.67,56.82 7.67,52.93 6.3,51.56 4.85,51.56 3.86,50.57 JP1.21
  Bottom 0.152: v26.8,73.28 25.43,73.28 J2.21
RFU_23  (via drill 0.25)
  Top 0.152: v26.8,72.44 25.2,72.44 J1.23
  Bottom 0.152: v26.8,72.44 25.43,72.44 J2.23 25.35,72.44 24.51,72.44 19.48,67.41 19.48,66.12 13.84,60.48 13.84,56.59 6.3,49.05 4.85,49.05 JP1.23
RFU_25  (via drill 0.25)
  Top 0.152: v26.8,71.68 25.2,71.68 J1.25
  Bottom 0.152: v26.8,71.68 25.43,71.68 J2.25 25.35,71.6 24.36,71.6 19.79,67.03 19.79,65.96 14.15,60.32 14.15,54.38 6.53,46.76 5.16,46.76 3.86,45.47 JP1.25
RFU_27  (via drill 0.25)
  Top 0.152: v26.8,70.84 25.2,70.84 J1.27 25.12,70.84 22.23,70.84 18.41,67.03 18.41,61.92 18.64,61.7 18.64,61.39 12.55,55.3 12.55,49.73 10.03,47.22 6.98,47.22 6.22,46.46 5.92,46.46 4.85,45.39 4.85,43.94 3.86,42.95 JP1.27
  Bottom 0.152: v26.8,70.84 25.43,70.84 J2.27
RFU_29  (via drill 0.25)
  Top 0.152: v23.52,70.08 25.12,70.08 J1.29 25.2,70 26.26,70 26.64,69.62 26.64,65.28 14.45,53.09 14.45,48.06 13.31,46.91 9.27,46.91 6.45,44.09 v6.38,44.09 6.07,44.09 4.85,42.88 4.85,41.43 JP1.29
  Bottom 0.152: v23.52,70.08 25.35,70.08 J2.29
RFU_31  (via drill 0.25)
  Top 0.152: v23.52,69.24 25.12,69.24 J1.31
  Bottom 0.152: J2.31 25.35,69.24 v23.52,69.24 14.45,60.17 14.45,54.23 6.68,46.46 5.92,46.46 4.85,45.39 4.85,38.84 3.86,37.85 JP1.31
RFU_33  (via drill 0.25)
  Top 0.152: v23.52,68.48 25.12,68.48 J1.33 | v10.95,46.38 10.8,46.38 7.37,42.95 7.37,42.49 6.3,41.43 5.92,41.43 4.85,40.36 4.85,39.98 3.71,38.84 3.33,38.84 2.79,38.3 2.79,36.32 JP1.33
  Bottom 0.152: v23.52,68.48 25.35,68.48 J2.33 25.43,68.4 26.26,68.4 26.64,68.02 26.64,65.73 23.29,62.38 17.8,62.38 15.06,59.64 15.06,53.62 10.95,49.5 v10.95,46.38
RFU_35  (via drill 0.25)
  Top 0.152: v23.52,67.64 25.12,67.64 J1.35 | v10.41,45.31 10.41,43.03 6.22,38.84 5.92,38.84 4.85,37.77 4.85,33.81 JP1.35
  Bottom 0.152: J2.35 25.35,67.64 v23.52,67.64 22.61,67.64 14.76,59.79 14.76,53.77 10.41,49.43 v10.41,45.31
RFU_37  (via drill 0.25)
  Top 0.152: J1.37 25.12,66.88 v23.52,66.88 v18.95,66.88
  Bottom 0.152: v23.52,66.88 25.35,66.88 J2.37 | v18.95,66.88 12.62,66.88 7.44,61.7 5.92,61.7 4.85,60.63 4.85,60.32 3.71,59.18 3.4,59.18 2.49,58.27 2.49,31.52 3.78,30.23 JP1.37
RS485_D_N  (via drill 0.25)
  Top 0.635: v39.78,72.2 39.77,72.23 38.4,70.86 32.21,70.86 | 32.21,70.86 J1.28 | v32.21,70.84 32.21,70.85 32.21,70.86 | v32.21,70.84
  Bottom 0.635: JP1.28 7.15,43.78 21.47,43.78 41.03,63.34 41.03,68.74 39.76,70.01 39.76,72.19 v39.78,72.2 | J2.28 30.17,70.88 32.21,70.88 v32.21,70.84
RS485_D_P  (via drill 0.25)
  Top 0.635: v38.96,72.58 38.97,72.55 38.08,71.66 32.28,71.66 | 32.28,71.66 J1.26 | 32.77,71.67 32.23,71.67 v32.23,71.68 32.28,71.68 32.28,71.66
  Bottom 0.635: JP1.26 7.2,44.56 21.15,44.56 40.25,63.66 40.25,68.42 38.98,69.69 38.98,72.56 v38.96,72.58 | J2.26 30.15,71.67 32.23,71.67 v32.23,71.68
SPI_MISO  (via drill 0.25)
  Top 0.152: v28.32,77.24 29.92,77.24 J1.12 | v43.33,69.32 43.33,52.17 45.77,49.73 45.77,44.47 JP6.2
  Bottom 0.152: v28.32,77.24 29.69,77.24 J2.12 29.77,77.24 31.75,77.24 32.13,77.62 32.13,78.61 32.36,78.84 33.96,78.84 34.07,78.96 | 34.07,78.96 34.11,78.99 34.11,81.13 33.88,81.36 31.52,81.36 28.02,84.86 25.4,84.86 24.43,83.9 22.78,83.9 18.57,79.68 18.57,77.01 15.52,73.97 7.21,73.97 6.76,74.42 5.92,74.42 5.31,73.81 5.31,64.29 JP1.12 | v43.33,69.32 43.33,71.98 43.56,72.21 43.56,72.52 40.13,75.95 38.08,75.95 35.1,78.92 34.11,78.92 34.07,78.96
SPI_MISO_R  (via drill 0.25)
  Top 0.152: U1.13 40.66,25.73 40.66,19.1 39.37,17.8 JP10.1 | v66.88,59.41 67.79,59.41 74.12,65.73 79.98,65.73 JP9.9 | v47.68,46.46 47.68,43.87 JP6.1
  Bottom 0.152: JP10.1 39.37,19.33 34.04,24.66 33.96,24.66 32.97,25.65 32.97,28.55 37.39,32.97 37.69,32.97 38.99,31.67 43.1,31.67 43.64,32.21 43.64,40.13 45.39,41.88 45.7,41.88 JP6.1 | v66.88,59.41 54.46,46.99 48.21,46.99 v47.68,46.46
SPI_MOSI  (via drill 0.25)
  Top 0.152: v28.32,76.48 29.92,76.48 J1.14 | v38.68,74.88 38.68,74.65 44.78,68.55 44.78,51.18 50.8,45.16 JP7.2
  Bottom 0.152: v28.32,76.48 29.69,76.48 J2.14 29.77,76.4 37.16,76.4 v38.68,74.88 | JP1.14 6.3,60.71 6.3,59.56 4.85,58.11 4.85,50.11 3.78,49.05 3.4,49.05 2.79,48.44 2.79,37.39 3.33,36.85 17.12,36.85 20.17,39.9 29.92,39.9 36.55,33.27 39.37,33.27 40.66,31.98 42.95,31.98 43.33,32.36 43.33,41.73 45.01,43.41 49.66,43.41 50.65,44.4 50.8,44.4 JP7.2
SPI_MOSI_R  (via drill 0.25)
  Top 0.152: JP10.2 41.5,18.19 41.5,23.82 41.66,23.98 41.66,25.73 U1.15 41.73,25.81 41.73,26.57 43.64,28.47 v43.64,28.63 | v52.86,46.46 52.86,44.02 50.8,41.96 JP7.1
  Bottom 0.152: JP7.1 50.8,35.79 v43.64,28.63 | v52.86,46.46 54.84,46.46 71.6,63.22 79.98,63.22 JP9.11
SPI_SCK  (via drill 0.25)
  Top 0.152: J1.16 29.92,75.64 v28.32,75.64 27.63,74.95 27.63,65.81 23.6,61.77 v23.6,61.54 | v43.03,72.36 43.03,72.14 48.74,66.42 48.74,54.38 55.83,47.3 55.83,44.47 JP8.2 | v13.31,58.19 14.07,58.19 17.42,61.54 v18.11,61.54
  Bottom 0.152: v28.32,75.64 29.69,75.64 J2.16 29.77,75.64 37.24,75.64 38.53,74.35 41.05,74.35 v43.03,72.36 | v13.31,58.19 6.38,58.19 JP1.16 | v23.6,61.54 v18.11,61.54
SPI_SCK_R  (via drill 0.25)
  Top 0.152: U1.16 42.11,25.73 42.11,23.98 41.81,23.67 41.81,20.4 44.4,17.8 JP10.3 | v49.51,20.78 57.58,28.85 v57.58,32.51 | v56.44,33.65 56.44,40.51 55.91,41.05 55.91,41.88 JP8.1
  Bottom 0.152: JP8.1 55.91,41.96 67.94,41.96 78.69,52.7 78.69,58.27 80.14,59.71 80.44,59.71 81.51,60.78 81.51,62.23 82.5,63.22 JP9.12 | v49.51,20.78 47.75,20.78 44.78,17.8 44.48,17.8 JP10.3 | v56.44,33.65 v57.58,32.51
SWCLK  (via drill 0.25)
  Top 0.152: U1.45 42.19,34.19 42.19,32.44 42.34,32.28 42.34,29.08 36.85,23.6 33.05,23.6 32.66,23.98 32.66,28.09 34.27,29.69 34.27,35.1 37.62,38.46 37.62,44.55 41.35,48.28 41.35,48.51 R4.1 41.43,48.51 42.34,49.43 v42.34,51.1 | v41.66,72.59 38.23,76.02 38.23,85.47 37.85,85.85 37.31,85.85 36.7,86.46 36.32,86.46 J6.4
  Bottom 0.152: v41.66,72.59 41.66,69.39 42.34,68.71 v42.34,51.1
SWDIO  (via drill 0.25)
  Top 0.152: v40.36,36.25 41.66,34.95 41.66,34.26 U1.46
  Bottom 0.152: v40.36,36.25 40.36,39.98 38.84,41.5 38.84,45.77 46.15,53.09 46.15,71.3 41.2,76.25 38.53,76.25 35.71,79.07 35.71,85.85 35.1,86.46 J6.2
UART_RX  (via drill 0.25)
  Top 0.152: v33.88,24.13 37.92,28.17 39.14,28.17 U1.10 | v29.08,15.44 29.08,7.75 29.84,6.98 67.94,6.98 85.24,24.28 85.24,67.56 82.58,70.23 82.58,70.84 JP9.6
  Bottom 0.152: v33.88,24.13 33.88,21.16 30.53,17.8 JP3.2 30.45,17.73 29.08,16.36 v29.08,15.44
UART_TX  (via drill 0.25)
  Top 0.152: v33.2,24.13 37.77,28.7 39.14,28.7 U1.9 | v57.73,60.55 56.29,60.55 55.91,60.93 v55.22,60.93 | v44.55,50.27 44.55,50.42 41.96,53.01 41.66,53.01 37.31,48.67 37.31,44.02 36.25,42.95 34.42,42.95 33.66,42.19 33.66,30 27.94,24.28 JP3.1
  Bottom 0.152: v33.2,24.13 33.2,23.06 27.94,17.8 JP3.1 | v57.73,60.55 58.8,61.62 63.37,61.62 69.09,67.33 80.44,67.33 81.05,67.94 81.05,69.7 80.06,70.69 80.06,70.84 JP9.5 | v44.55,50.27 v55.22,60.93

### Text on the board
tPlace: GND +VBAT GND +12V GND +5V GND +3V3
tNames: 1 | 2 | 39 | 40